# Altium project RK3566.PrjPcb (part 1 of 3)
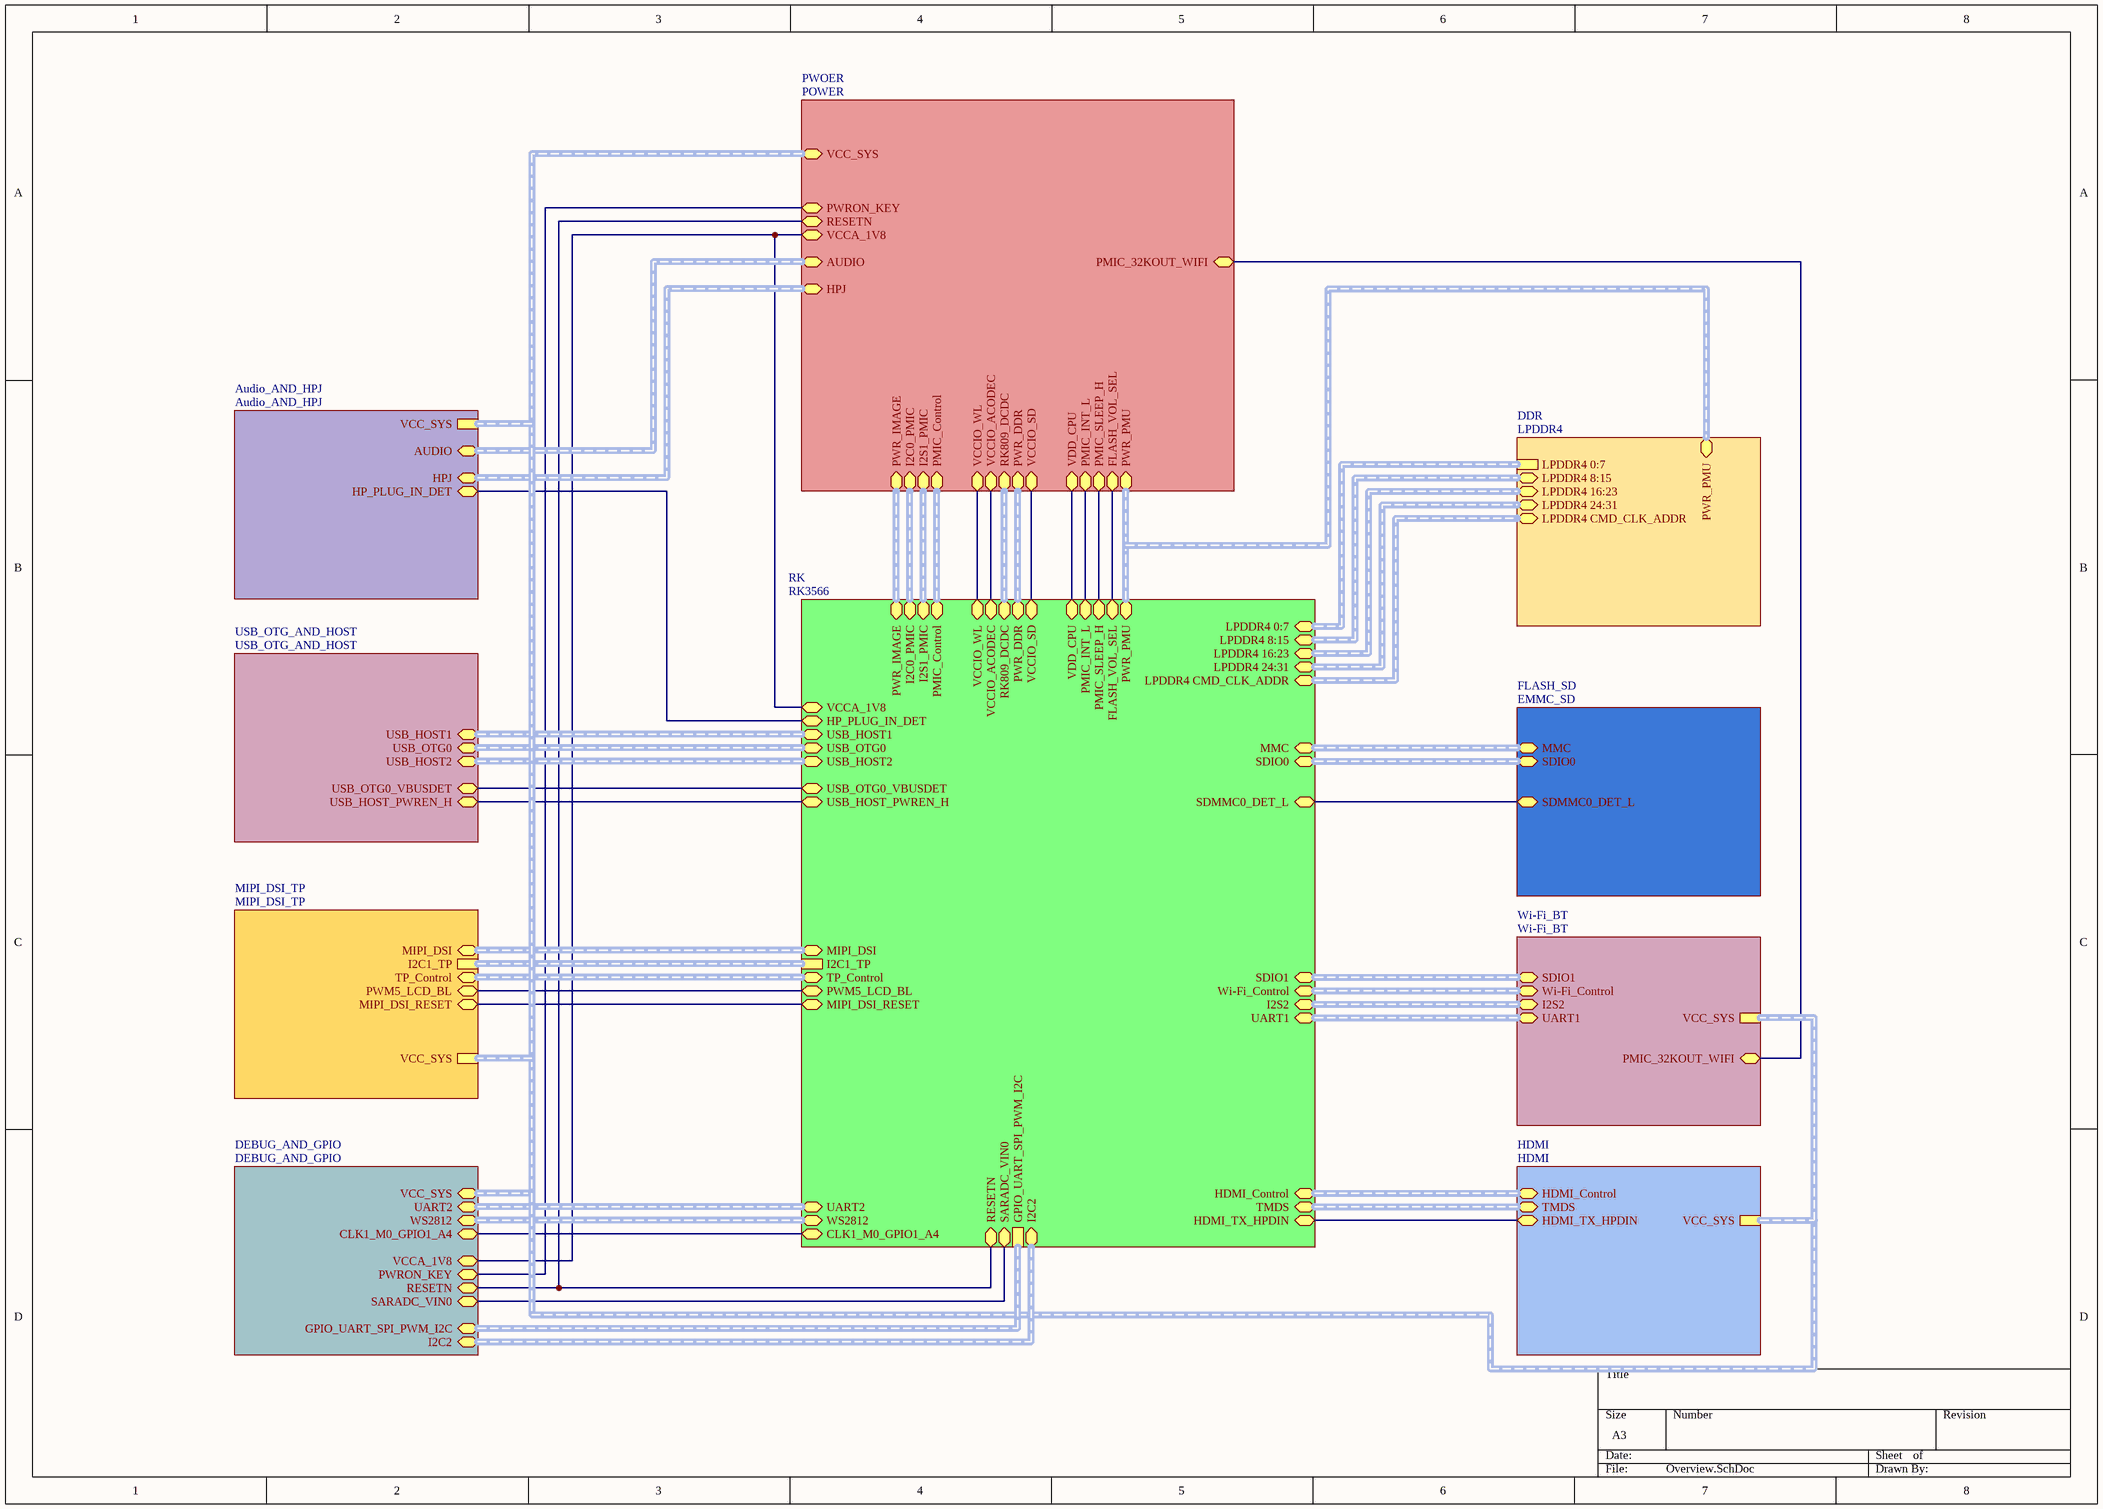
[diagram p0: Overview.SchDoc]
20 sheets, 462 parts. Net scope: hierarchical (ports join the sheet entries above them; power ports are global).
Board file: PCB1.PcbDoc
Sheets:
  Overview.SchDoc
    RK = RK3566.SchDoc
      RK_DDR = RK3566_DDR_PHY.SchDoc
      RK_FLASH_SD_SARADC = RK3566_FLASH_SD_SARADC.SchDoc
      RK_USB_GPIO = RK3566_USB_GPIO.SchDoc
      RK_MIPI_HDMI = RK3566_MIPI_HDMI.SchDoc
      RK_OSC_PLL_PMUO1_2 = RK3566_OSC_PLL_PMUO1_2.SchDoc
      RK_POWER = RK3566_POWER.SchDoc
    DDR = LPDDR4.SchDoc
    FLASH_SD = EMMC_SD.SchDoc
    Wi-Fi_BT = Wi-Fi_BT.SchDoc
    HDMI = HDMI.SchDoc
    MIPI_DSI_TP = MIPI_DSI_TP.SchDoc
    PWOER = POWER.SchDoc
      POWER_PMIC = POWER_PMIC.SchDoc
      POWER_EXTENSION = POWER_EXTENSION.SchDoc
      POWER_FLASH_POWER_MANAGE = POWER_FLASH_POWER_MANAGE.SchDoc
    Audio_AND_HPJ = Audio_AND_HPJ.SchDoc
    DEBUG_AND_GPIO = DEBUG_AND_GPIO.SchDoc
    USB_OTG_AND_HOST = USB_OTG_AND_HOST.SchDoc

## Sheet Overview.SchDoc
size A3; SheetNumber: 1; SheetTotal: 20

### Sub-sheets
Audio_AND_HPJ = Audio_AND_HPJ: AUDIO (bidir), HPJ (bidir), HP_PLUG_IN_DET (bidir), VCC_SYS
DDR = LPDDR4: LPDDR4 0:7, LPDDR4 8:15 (bidir), LPDDR4 16:23 (bidir), LPDDR4 24:31 (bidir), LPDDR4 CMD_CLK_ADDR (bidir), PWR_PMU (bidir)
DEBUG_AND_GPIO = DEBUG_AND_GPIO: UART2 (bidir), WS2812 (bidir), CLK1_M0_GPIO1_A4 (bidir), RESETN (bidir), PWRON_KEY (bidir), SARADC_VIN0 (bidir), VCC_SYS (bidir), VCCA_1V8 (bidir), GPIO_UART_SPI_PWM_I2C (bidir), I2C2 (bidir)
FLASH_SD = EMMC_SD: MMC (bidir), SDIO0 (bidir), SDMMC0_DET_L (bidir)
HDMI = HDMI: TMDS (bidir), HDMI_Control (bidir), HDMI_TX_HPDIN (bidir), VCC_SYS
MIPI_DSI_TP = MIPI_DSI_TP: MIPI_DSI (bidir), I2C1_TP, PWM5_LCD_BL (bidir), MIPI_DSI_RESET (bidir), TP_Control (bidir), VCC_SYS
PWOER = POWER: I2S1_PMIC (bidir), PMIC_Control (bidir), I2C0_PMIC (bidir), AUDIO (bidir), RK809_DCDC (bidir), PMIC_32KOUT_WIFI (bidir), HPJ (bidir), PWR_DDR (bidir), VCCIO_SD (bidir), VCCIO_ACODEC (bidir), VCCIO_WL (bidir), PWR_IMAGE (bidir), VDD_CPU (bidir), PMIC_INT_L (bidir), PMIC_SLEEP_H (bidir), FLASH_VOL_SEL (bidir), PWR_PMU (bidir), PWRON_KEY (bidir), VCC_SYS (bidir), RESETN (bidir), VCCA_1V8 (bidir)
RK = RK3566: LPDDR4 0:7 (bidir), LPDDR4 8:15 (bidir), LPDDR4 16:23 (bidir), LPDDR4 24:31 (bidir), LPDDR4 CMD_CLK_ADDR (bidir), MIPI_DSI (bidir), MMC (bidir), SDIO0 (bidir), SDMMC0_DET_L (bidir), I2C1_TP, TP_Control (bidir), PWM5_LCD_BL (bidir), MIPI_DSI_RESET (bidir), SDIO1 (bidir), Wi-Fi_Control (bidir), I2S2 (bidir), UART1 (bidir), HDMI_Control (bidir), TMDS (bidir), HDMI_TX_HPDIN (bidir), I2S1_PMIC (bidir), PMIC_Control (bidir), I2C0_PMIC (bidir), RK809_DCDC (bidir), UART2 (bidir), USB_OTG0 (bidir), USB_HOST2 (bidir), USB_OTG0_VBUSDET (bidir), USB_HOST_PWREN_H (bidir), USB_HOST1 (bidir), HP_PLUG_IN_DET (bidir), PWR_DDR (bidir), VCCIO_SD (bidir), VCCIO_ACODEC (bidir), VCCIO_WL (bidir), WS2812 (bidir), CLK1_M0_GPIO1_A4 (bidir), PWR_IMAGE (bidir), VDD_CPU (bidir), PMIC_INT_L (bidir), PMIC_SLEEP_H (bidir), FLASH_VOL_SEL (bidir), PWR_PMU (bidir), RESETN (bidir), SARADC_VIN0 (bidir), VCCA_1V8 (bidir), GPIO_UART_SPI_PWM_I2C, I2C2 (bidir)
USB_OTG_AND_HOST = USB_OTG_AND_HOST: USB_OTG0 (bidir), USB_HOST2 (bidir), USB_OTG0_VBUSDET (bidir), USB_HOST_PWREN_H (bidir), USB_HOST1 (bidir)
Wi-Fi_BT = Wi-Fi_BT: SDIO1 (bidir), Wi-Fi_Control (bidir), I2S2 (bidir), UART1 (bidir), PMIC_32KOUT_WIFI (bidir), VCC_SYS

### Nets
VCCA_1V8: sheet RK/VCCA_1V8, sheet PWOER/VCCA_1V8, sheet DEBUG_AND_GPIO/VCCA_1V8
VCCIO_ACODEC: sheet RK/VCCIO_ACODEC, sheet PWOER/VCCIO_ACODEC
VCCIO_SD: sheet RK/VCCIO_SD, sheet PWOER/VCCIO_SD
VCCIO_WL: sheet RK/VCCIO_WL, sheet PWOER/VCCIO_WL
VDD_CPU: sheet RK/VDD_CPU, sheet PWOER/VDD_CPU
CLK1_M0_GPIO1_A4: sheet RK/CLK1_M0_GPIO1_A4, sheet DEBUG_AND_GPIO/CLK1_M0_GPIO1_A4
FLASH_VOL_SEL: sheet RK/FLASH_VOL_SEL, sheet PWOER/FLASH_VOL_SEL
HDMI_TX_HPDIN: sheet RK/HDMI_TX_HPDIN, sheet HDMI/HDMI_TX_HPDIN
HP_PLUG_IN_DET: sheet RK/HP_PLUG_IN_DET, sheet Audio_AND_HPJ/HP_PLUG_IN_DET
MIPI_DSI_RESET: sheet RK/MIPI_DSI_RESET, sheet MIPI_DSI_TP/MIPI_DSI_RESET
PMIC_32KOUT_WIFI: sheet Wi-Fi_BT/PMIC_32KOUT_WIFI, sheet PWOER/PMIC_32KOUT_WIFI
PMIC_INT_L: sheet RK/PMIC_INT_L, sheet PWOER/PMIC_INT_L
PMIC_SLEEP_H: sheet RK/PMIC_SLEEP_H, sheet PWOER/PMIC_SLEEP_H
PWM5_LCD_BL: sheet RK/PWM5_LCD_BL, sheet MIPI_DSI_TP/PWM5_LCD_BL
PWRON_KEY: sheet PWOER/PWRON_KEY, sheet DEBUG_AND_GPIO/PWRON_KEY
RESETN: sheet RK/RESETN, sheet PWOER/RESETN, sheet DEBUG_AND_GPIO/RESETN
SARADC_VIN0: sheet RK/SARADC_VIN0, sheet DEBUG_AND_GPIO/SARADC_VIN0
SDMMC0_DET_L: sheet RK/SDMMC0_DET_L, sheet FLASH_SD/SDMMC0_DET_L
USB_HOST_PWREN_H: sheet RK/USB_HOST_PWREN_H, sheet USB_OTG_AND_HOST/USB_HOST_PWREN_H
USB_OTG0_VBUSDET: sheet RK/USB_OTG0_VBUSDET, sheet USB_OTG_AND_HOST/USB_OTG0_VBUSDET

### Buses and harness runs
harness sheet Audio_AND_HPJ/AUDIO = sheet PWOER/AUDIO
harness sheet Audio_AND_HPJ/HPJ = sheet PWOER/HPJ
harness sheet Audio_AND_HPJ/VCC_SYS = sheet DEBUG_AND_GPIO/VCC_SYS = sheet HDMI/VCC_SYS = sheet MIPI_DSI_TP/VCC_SYS = sheet PWOER/VCC_SYS = sheet Wi-Fi_BT/VCC_SYS
harness sheet DDR/LPDDR4 0:7 = sheet RK/LPDDR4 0:7
harness sheet DDR/LPDDR4 8:15 = sheet RK/LPDDR4 8:15
harness sheet DDR/LPDDR4 16:23 = sheet RK/LPDDR4 16:23
harness sheet DDR/LPDDR4 24:31 = sheet RK/LPDDR4 24:31
harness sheet DDR/LPDDR4 CMD_CLK_ADDR = sheet RK/LPDDR4 CMD_CLK_ADDR
harness sheet DDR/PWR_PMU = sheet PWOER/PWR_PMU = sheet RK/PWR_PMU
harness sheet DEBUG_AND_GPIO/GPIO_UART_SPI_PWM_I2C = sheet RK/GPIO_UART_SPI_PWM_I2C
harness sheet DEBUG_AND_GPIO/I2C2 = sheet RK/I2C2
harness sheet DEBUG_AND_GPIO/UART2 = sheet RK/UART2
harness sheet DEBUG_AND_GPIO/WS2812 = sheet RK/WS2812
harness sheet FLASH_SD/MMC = sheet RK/MMC
harness sheet FLASH_SD/SDIO0 = sheet RK/SDIO0
harness sheet HDMI/HDMI_Control = sheet RK/HDMI_Control
harness sheet HDMI/TMDS = sheet RK/TMDS
harness sheet MIPI_DSI_TP/I2C1_TP = sheet RK/I2C1_TP
harness sheet MIPI_DSI_TP/MIPI_DSI = sheet RK/MIPI_DSI
harness sheet MIPI_DSI_TP/TP_Control = sheet RK/TP_Control
harness sheet PWOER/I2C0_PMIC = sheet RK/I2C0_PMIC
harness sheet PWOER/I2S1_PMIC = sheet RK/I2S1_PMIC
harness sheet PWOER/PMIC_Control = sheet RK/PMIC_Control
harness sheet PWOER/PWR_DDR = sheet RK/PWR_DDR
harness sheet PWOER/PWR_IMAGE = sheet RK/PWR_IMAGE
harness sheet PWOER/RK809_DCDC = sheet RK/RK809_DCDC
harness sheet RK/I2S2 = sheet Wi-Fi_BT/I2S2
harness sheet RK/SDIO1 = sheet Wi-Fi_BT/SDIO1
harness sheet RK/UART1 = sheet Wi-Fi_BT/UART1
harness sheet RK/USB_HOST1 = sheet USB_OTG_AND_HOST/USB_HOST1
harness sheet RK/USB_HOST2 = sheet USB_OTG_AND_HOST/USB_HOST2
harness sheet RK/USB_OTG0 = sheet USB_OTG_AND_HOST/USB_OTG0
harness sheet RK/Wi-Fi_Control = sheet Wi-Fi_BT/Wi-Fi_Control

## Sheet RK3566.SchDoc
size A3; SheetNumber: 14; SheetTotal: 20
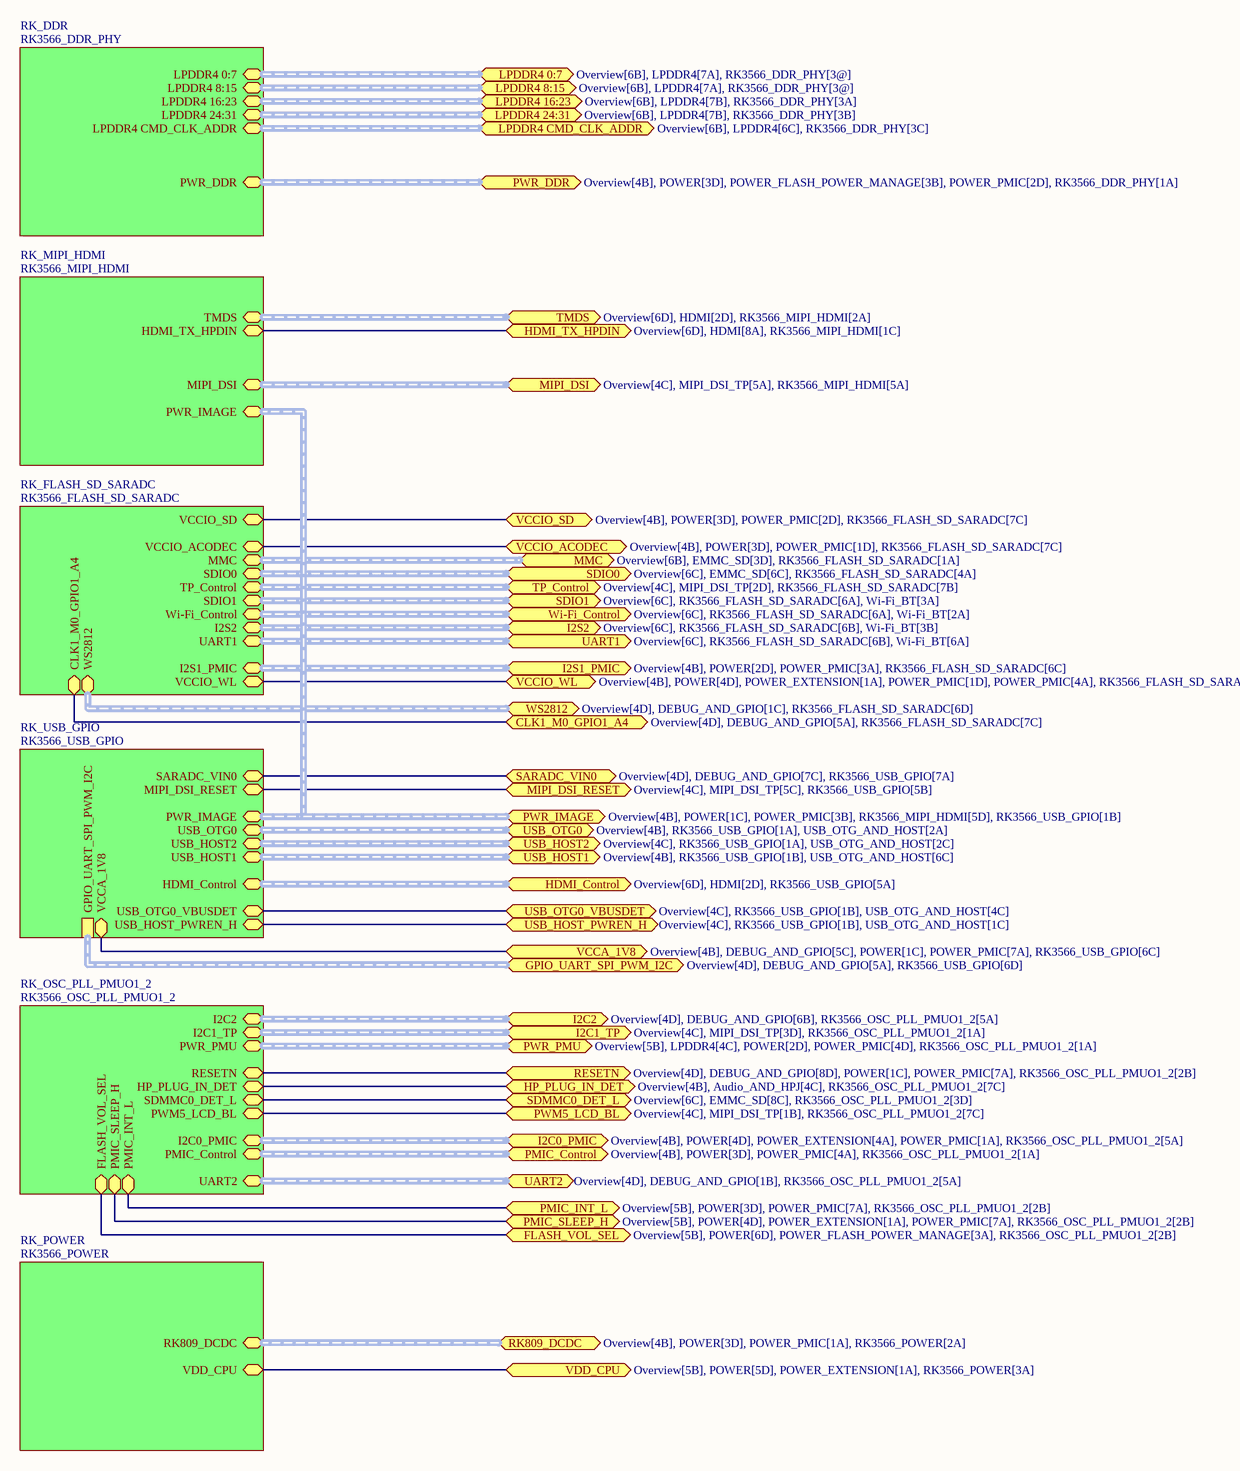
[diagram p1: RK3566.SchDoc]

### Sub-sheets
RK_DDR = RK3566_DDR_PHY: LPDDR4 0:7 (bidir), LPDDR4 8:15 (bidir), LPDDR4 16:23 (bidir), LPDDR4 24:31 (bidir), LPDDR4 CMD_CLK_ADDR (bidir), PWR_DDR (bidir)
RK_FLASH_SD_SARADC = RK3566_FLASH_SD_SARADC: MMC (bidir), SDIO0 (bidir), SDIO1 (bidir), Wi-Fi_Control (bidir), I2S2 (bidir), UART1 (bidir), TP_Control (bidir), I2S1_PMIC (bidir), VCCIO_SD (bidir), VCCIO_ACODEC (bidir), VCCIO_WL (bidir), CLK1_M0_GPIO1_A4 (bidir), WS2812 (bidir)
RK_MIPI_HDMI = RK3566_MIPI_HDMI: TMDS (bidir), MIPI_DSI (bidir), HDMI_TX_HPDIN (bidir), PWR_IMAGE (bidir)
RK_OSC_PLL_PMUO1_2 = RK3566_OSC_PLL_PMUO1_2: I2C1_TP (bidir), PWM5_LCD_BL (bidir), SDMMC0_DET_L (bidir), PMIC_Control (bidir), I2C0_PMIC (bidir), UART2 (bidir), HP_PLUG_IN_DET (bidir), PWR_PMU (bidir), PMIC_INT_L (bidir), PMIC_SLEEP_H (bidir), FLASH_VOL_SEL (bidir), RESETN (bidir), I2C2 (bidir)
RK_POWER = RK3566_POWER: RK809_DCDC (bidir), VDD_CPU (bidir)
RK_USB_GPIO = RK3566_USB_GPIO: HDMI_Control (bidir), MIPI_DSI_RESET (bidir), USB_OTG0 (bidir), USB_HOST2 (bidir), USB_OTG0_VBUSDET (bidir), USB_HOST_PWREN_H (bidir), USB_HOST1 (bidir), PWR_IMAGE (bidir), SARADC_VIN0 (bidir), VCCA_1V8 (bidir), GPIO_UART_SPI_PWM_I2C

### Ports
CLK1_M0_GPIO1_A4 (bidir, see Overview[4D], DEBUG_AND_GPIO[5A], RK3566_FLASH_SD_SARADC[7C]), FLASH_VOL_SEL (bidir, see Overview[5B], POWER[6D], POWER_FLASH_POWER_MANAGE[3A], RK3566_OSC_PLL_PMUO1_2[2B]), GPIO_UART_SPI_PWM_I2C (bidir, harness GPIO_UART_SPI_PWM_I2C, see Overview[4D], DEBUG_AND_GPIO[5A], RK3566_USB_GPIO[6D]), HDMI_Control (bidir, see Overview[6D], HDMI[2D], RK3566_USB_GPIO[5A]), HDMI_TX_HPDIN (bidir, see Overview[6D], HDMI[8A], RK3566_MIPI_HDMI[1C]), HP_PLUG_IN_DET (bidir, see Overview[4B], Audio_AND_HPJ[4C], RK3566_OSC_PLL_PMUO1_2[7C]), I2C0_PMIC (bidir, harness PMIC_Control, see Overview[4B], POWER[4D], POWER_EXTENSION[4A], POWER_PMIC[1A], RK3566_OSC_PLL_PMUO1_2[5A]), I2C1_TP (bidir, see Overview[4C], MIPI_DSI_TP[3D], RK3566_OSC_PLL_PMUO1_2[1A]), I2C2 (bidir, harness I2C2, see Overview[4D], DEBUG_AND_GPIO[6B], RK3566_OSC_PLL_PMUO1_2[5A]), I2S1_PMIC (bidir, see Overview[4B], POWER[2D], POWER_PMIC[3A], RK3566_FLASH_SD_SARADC[6C]), I2S2 (bidir, see Overview[6C], RK3566_FLASH_SD_SARADC[6B], Wi-Fi_BT[3B]), LPDDR4 0:7 (bidir, see Overview[6B], LPDDR4[7A], RK3566_DDR_PHY[3@]), LPDDR4 8:15 (bidir, see Overview[6B], LPDDR4[7A], RK3566_DDR_PHY[3@]), LPDDR4 16:23 (bidir, see Overview[6B], LPDDR4[7B], RK3566_DDR_PHY[3A]), LPDDR4 24:31 (bidir, see Overview[6B], LPDDR4[7B], RK3566_DDR_PHY[3B]), LPDDR4 CMD_CLK_ADDR (bidir, see Overview[6B], LPDDR4[6C], RK3566_DDR_PHY[3C]), MIPI_DSI (bidir, see Overview[4C], MIPI_DSI_TP[5A], RK3566_MIPI_HDMI[5A]), MIPI_DSI_RESET (bidir, see Overview[4C], MIPI_DSI_TP[5C], RK3566_USB_GPIO[5B]), MMC (bidir, see Overview[6B], EMMC_SD[3D], RK3566_FLASH_SD_SARADC[1A]), PMIC_Control (bidir, harness PMIC_Control, see Overview[4B], POWER[3D], POWER_PMIC[4A], RK3566_OSC_PLL_PMUO1_2[1A]), PMIC_INT_L (bidir, see Overview[5B], POWER[3D], POWER_PMIC[7A], RK3566_OSC_PLL_PMUO1_2[2B]), PMIC_SLEEP_H (bidir, see Overview[5B], POWER[4D], POWER_EXTENSION[1A], POWER_PMIC[7A], RK3566_OSC_PLL_PMUO1_2[2B]), PWM5_LCD_BL (bidir, see Overview[4C], MIPI_DSI_TP[1B], RK3566_OSC_PLL_PMUO1_2[7C]), PWR_DDR (bidir, harness PWR_DDR, see Overview[4B], POWER[3D], POWER_FLASH_POWER_MANAGE[3B], POWER_PMIC[2D], RK3566_DDR_PHY[1A]), PWR_IMAGE (bidir, harness PWR_IMAGE, see Overview[4B], POWER[1C], POWER_PMIC[3B], RK3566_MIPI_HDMI[5D], RK3566_USB_GPIO[1B]), PWR_PMU (bidir, harness PWR_PMU, see Overview[5B], LPDDR4[4C], POWER[2D], POWER_PMIC[4D], RK3566_OSC_PLL_PMUO1_2[1A]), RESETN (bidir, see Overview[4D], DEBUG_AND_GPIO[8D], POWER[1C], POWER_PMIC[7A], RK3566_OSC_PLL_PMUO1_2[2B]), RK809_DCDC (bidir, harness RK809_DCDC, see Overview[4B], POWER[3D], POWER_PMIC[1A], RK3566_POWER[2A]), SARADC_VIN0 (bidir, see Overview[4D], DEBUG_AND_GPIO[7C], RK3566_USB_GPIO[7A]), SDIO0 (bidir, see Overview[6C], EMMC_SD[6C], RK3566_FLASH_SD_SARADC[4A]), SDIO1 (bidir, see Overview[6C], RK3566_FLASH_SD_SARADC[6A], Wi-Fi_BT[3A]), SDMMC0_DET_L (bidir, see Overview[6C], EMMC_SD[8C], RK3566_OSC_PLL_PMUO1_2[3D]), TMDS (bidir, see Overview[6D], HDMI[2D], RK3566_MIPI_HDMI[2A]), TP_Control (bidir, see Overview[4C], MIPI_DSI_TP[2D], RK3566_FLASH_SD_SARADC[7B]), UART1 (bidir, see Overview[6C], RK3566_FLASH_SD_SARADC[6B], Wi-Fi_BT[6A]), UART2 (bidir, harness PMIC_Control, see Overview[4D], DEBUG_AND_GPIO[1B], RK3566_OSC_PLL_PMUO1_2[5A]), USB_HOST1 (bidir, harness USB_HOST2, see Overview[4B], RK3566_USB_GPIO[1B], USB_OTG_AND_HOST[6C]), USB_HOST2 (bidir, harness USB_HOST2, see Overview[4C], RK3566_USB_GPIO[1A], USB_OTG_AND_HOST[2C]), USB_HOST_PWREN_H (bidir, see Overview[4C], RK3566_USB_GPIO[1B], USB_OTG_AND_HOST[1C]), USB_OTG0 (bidir, harness USB_OTG0, see Overview[4B], RK3566_USB_GPIO[1A], USB_OTG_AND_HOST[2A]), USB_OTG0_VBUSDET (bidir, see Overview[4C], RK3566_USB_GPIO[1B], USB_OTG_AND_HOST[4C]), VCCA_1V8 (bidir, see Overview[4B], DEBUG_AND_GPIO[5C], POWER[1C], POWER_PMIC[7A], RK3566_USB_GPIO[6C]), VCCIO_ACODEC (bidir, see Overview[4B], POWER[3D], POWER_PMIC[1D], RK3566_FLASH_SD_SARADC[7C]), VCCIO_SD (bidir, see Overview[4B], POWER[3D], POWER_PMIC[2D], RK3566_FLASH_SD_SARADC[7C]), VCCIO_WL (bidir, see Overview[4B], POWER[4D], POWER_EXTENSION[1A], POWER_PMIC[1D], POWER_PMIC[4A], RK3566_FLASH_SD_SARADC[7C]), VDD_CPU (bidir, see Overview[5B], POWER[5D], POWER_EXTENSION[1A], RK3566_POWER[3A]), Wi-Fi_Control (bidir, see Overview[6C], RK3566_FLASH_SD_SARADC[6A], Wi-Fi_BT[2A]), WS2812 (bidir, harness WS2812, see Overview[4D], DEBUG_AND_GPIO[1C], RK3566_FLASH_SD_SARADC[6D])

### Nets
VCCA_1V8: port VCCA_1V8, sheet RK_USB_GPIO/VCCA_1V8
VCCIO_ACODEC: port VCCIO_ACODEC, sheet RK_FLASH_SD_SARADC/VCCIO_ACODEC
VCCIO_SD: port VCCIO_SD, sheet RK_FLASH_SD_SARADC/VCCIO_SD
VCCIO_WL: port VCCIO_WL, sheet RK_FLASH_SD_SARADC/VCCIO_WL
VDD_CPU: port VDD_CPU, sheet RK_POWER/VDD_CPU
CLK1_M0_GPIO1_A4: port CLK1_M0_GPIO1_A4, sheet RK_FLASH_SD_SARADC/CLK1_M0_GPIO1_A4
FLASH_VOL_SEL: port FLASH_VOL_SEL, sheet RK_OSC_PLL_PMUO1_2/FLASH_VOL_SEL
HDMI_TX_HPDIN: port HDMI_TX_HPDIN, sheet RK_MIPI_HDMI/HDMI_TX_HPDIN
HP_PLUG_IN_DET: port HP_PLUG_IN_DET, sheet RK_OSC_PLL_PMUO1_2/HP_PLUG_IN_DET
MIPI_DSI_RESET: port MIPI_DSI_RESET, sheet RK_USB_GPIO/MIPI_DSI_RESET
PMIC_INT_L: port PMIC_INT_L, sheet RK_OSC_PLL_PMUO1_2/PMIC_INT_L
PMIC_SLEEP_H: port PMIC_SLEEP_H, sheet RK_OSC_PLL_PMUO1_2/PMIC_SLEEP_H
PWM5_LCD_BL: port PWM5_LCD_BL, sheet RK_OSC_PLL_PMUO1_2/PWM5_LCD_BL
RESETN: port RESETN, sheet RK_OSC_PLL_PMUO1_2/RESETN
SARADC_VIN0: port SARADC_VIN0, sheet RK_USB_GPIO/SARADC_VIN0
SDMMC0_DET_L: port SDMMC0_DET_L, sheet RK_OSC_PLL_PMUO1_2/SDMMC0_DET_L
USB_HOST_PWREN_H: port USB_HOST_PWREN_H, sheet RK_USB_GPIO/USB_HOST_PWREN_H
USB_OTG0_VBUSDET: port USB_OTG0_VBUSDET, sheet RK_USB_GPIO/USB_OTG0_VBUSDET

### Buses and harness runs
harness port GPIO_UART_SPI_PWM_I2C = sheet RK_USB_GPIO/GPIO_UART_SPI_PWM_I2C
harness port HDMI_Control = sheet RK_USB_GPIO/HDMI_Control
harness port I2C0_PMIC = sheet RK_OSC_PLL_PMUO1_2/I2C0_PMIC
harness port I2C1_TP = sheet RK_OSC_PLL_PMUO1_2/I2C1_TP
harness port I2C2 = sheet RK_OSC_PLL_PMUO1_2/I2C2
harness port I2S1_PMIC = sheet RK_FLASH_SD_SARADC/I2S1_PMIC
harness port I2S2 = sheet RK_FLASH_SD_SARADC/I2S2
harness port LPDDR4 0:7 = sheet RK_DDR/LPDDR4 0:7
harness port LPDDR4 8:15 = sheet RK_DDR/LPDDR4 8:15
harness port LPDDR4 16:23 = sheet RK_DDR/LPDDR4 16:23
harness port LPDDR4 24:31 = sheet RK_DDR/LPDDR4 24:31
harness port LPDDR4 CMD_CLK_ADDR = sheet RK_DDR/LPDDR4 CMD_CLK_ADDR
harness port MIPI_DSI = sheet RK_MIPI_HDMI/MIPI_DSI
harness port MMC = sheet RK_FLASH_SD_SARADC/MMC
harness port PMIC_Control = sheet RK_OSC_PLL_PMUO1_2/PMIC_Control
harness port PWR_DDR = sheet RK_DDR/PWR_DDR
harness port PWR_IMAGE = sheet RK_MIPI_HDMI/PWR_IMAGE = sheet RK_USB_GPIO/PWR_IMAGE
harness port PWR_PMU = sheet RK_OSC_PLL_PMUO1_2/PWR_PMU
harness port RK809_DCDC = sheet RK_POWER/RK809_DCDC
harness port SDIO0 = sheet RK_FLASH_SD_SARADC/SDIO0
harness port SDIO1 = sheet RK_FLASH_SD_SARADC/SDIO1
harness port TMDS = sheet RK_MIPI_HDMI/TMDS
harness port TP_Control = sheet RK_FLASH_SD_SARADC/TP_Control
harness port UART1 = sheet RK_FLASH_SD_SARADC/UART1
harness port UART2 = sheet RK_OSC_PLL_PMUO1_2/UART2
harness port USB_HOST1 = sheet RK_USB_GPIO/USB_HOST1
harness port USB_HOST2 = sheet RK_USB_GPIO/USB_HOST2
harness port USB_OTG0 = sheet RK_USB_GPIO/USB_OTG0
harness port Wi-Fi_Control = sheet RK_FLASH_SD_SARADC/Wi-Fi_Control
harness port WS2812 = sheet RK_FLASH_SD_SARADC/WS2812

## Sheet RK3566_DDR_PHY.SchDoc
size A4; SheetNumber: 16; SheetTotal: 20
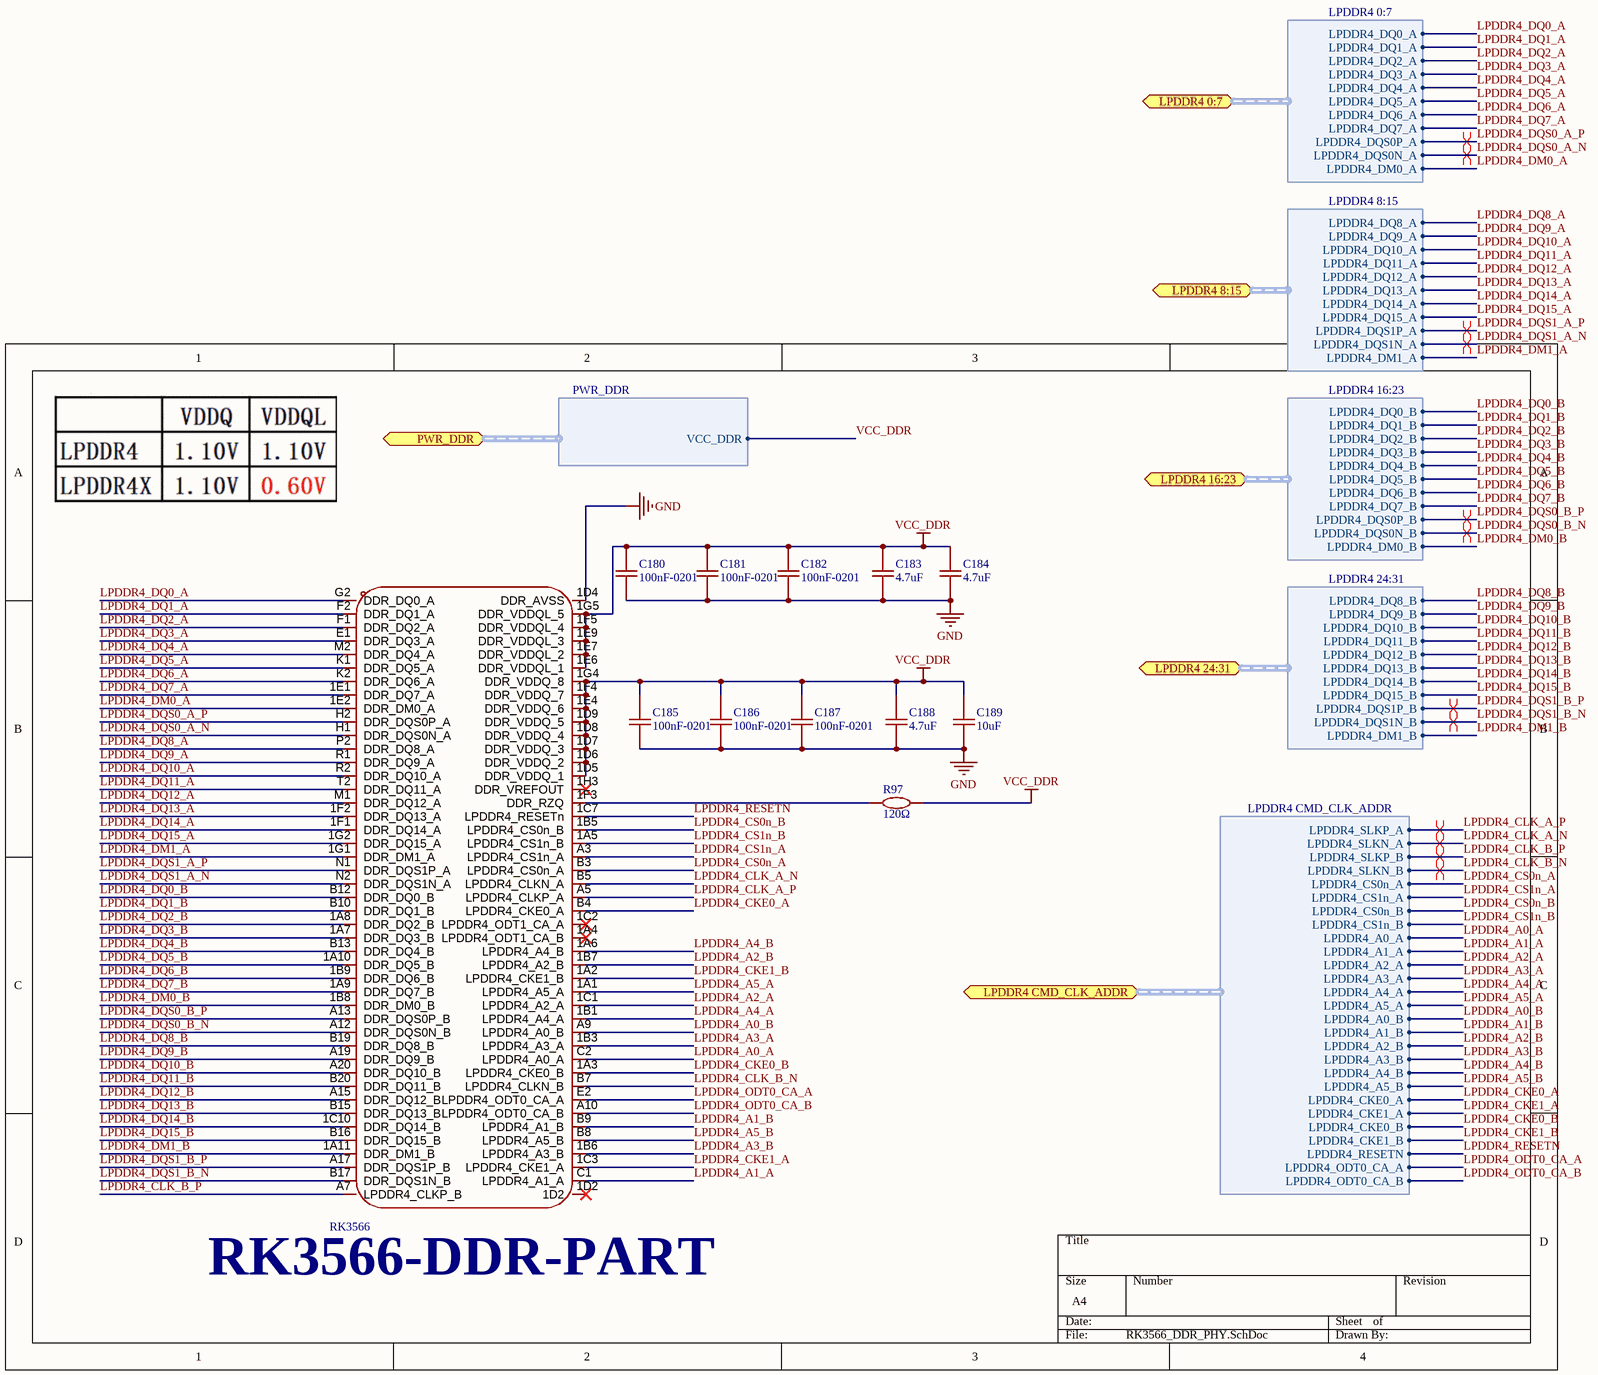
[diagram p2: RK3566_DDR_PHY.SchDoc]

### Parts
C180  100nF-0201  [C0201]
C181  100nF-0201  [C0201]
C182  100nF-0201  [C0201]
C183  4.7uF  [C0402]
C184  4.7uF  [C0402]
C185  100nF-0201  [C0201]
C186  100nF-0201  [C0201]
C187  100nF-0201  [C0201]
C188  4.7uF  [C0402]
C189  10uF  [C0603]
R97  120Ω  [R0402]
U2  RK3566  [BGA-565_L15.5-W14.4-P0.40_RK3566_1]  (part C of 8)

### Ports
LPDDR4 0:7 (bidir, harness LPDDR4 0:7, see RK3566[2A], LPDDR4[7A], RK3566[2A]), LPDDR4 8:15 (bidir, harness LPDDR4 8:15, see RK3566[2A], LPDDR4[7A], RK3566[2A]), LPDDR4 16:23 (bidir, harness LPDDR4 16:23, see RK3566[2A], LPDDR4[7B], RK3566[2A]), LPDDR4 24:31 (bidir, harness LPDDR4 24:31, see RK3566[2A], LPDDR4[7B], RK3566[2A]), LPDDR4 CMD_CLK_ADDR (bidir, harness LPDDR4 CMD_CLK_ADDR, see RK3566[2A], LPDDR4[6C], RK3566[2A]), PWR_DDR (bidir, harness PWR_DDR, see RK3566[2A], POWER[3D], POWER_FLASH_POWER_MANAGE[3B], POWER_PMIC[2D], RK3566[2A])

### Harnesses
PWR_DDR: VCC_DDR
LPDDR4 0:7: LPDDR4_DQ0_A, LPDDR4_DQ1_A, LPDDR4_DQ2_A, LPDDR4_DQ3_A, LPDDR4_DQ4_A, LPDDR4_DQ5_A, LPDDR4_DQ6_A, LPDDR4_DQ7_A, LPDDR4_DQS0P_A, LPDDR4_DQS0N_A, LPDDR4_DM0_A
LPDDR4 8:15: LPDDR4_DQ8_A, LPDDR4_DQ9_A, LPDDR4_DQ10_A, LPDDR4_DQ11_A, LPDDR4_DQ12_A, LPDDR4_DQ13_A, LPDDR4_DQ14_A, LPDDR4_DQ15_A, LPDDR4_DQS1P_A, LPDDR4_DQS1N_A, LPDDR4_DM1_A
LPDDR4 16:23: LPDDR4_DQ0_B, LPDDR4_DQ1_B, LPDDR4_DQ2_B, LPDDR4_DQ3_B, LPDDR4_DQ4_B, LPDDR4_DQ5_B, LPDDR4_DQ6_B, LPDDR4_DQ7_B, LPDDR4_DQS0P_B, LPDDR4_DQS0N_B, LPDDR4_DM0_B
LPDDR4 24:31: LPDDR4_DQ8_B, LPDDR4_DQ9_B, LPDDR4_DQ10_B, LPDDR4_DQ11_B, LPDDR4_DQ12_B, LPDDR4_DQ13_B, LPDDR4_DQ14_B, LPDDR4_DQ15_B, LPDDR4_DQS1P_B, LPDDR4_DQS1N_B, LPDDR4_DM1_B
LPDDR4 CMD_CLK_ADDR: LPDDR4_SLKP_A, LPDDR4_SLKN_A, LPDDR4_SLKP_B, LPDDR4_SLKN_B, LPDDR4_CS0n_A, LPDDR4_CS1n_A, LPDDR4_CS0n_B, LPDDR4_CS1n_B, LPDDR4_A0_A, LPDDR4_A1_A, LPDDR4_A2_A, LPDDR4_A3_A, LPDDR4_A4_A, LPDDR4_A5_A, LPDDR4_A0_B, LPDDR4_A1_B, LPDDR4_A2_B, LPDDR4_A3_B, LPDDR4_A4_B, LPDDR4_A5_B, LPDDR4_CKE0_A, LPDDR4_CKE1_A, LPDDR4_CKE0_B, LPDDR4_CKE1_B, LPDDR4_RESETN, LPDDR4_ODT0_CA_A, LPDDR4_ODT0_CA_B

### Nets
GND: C180.1 C181.1 C182.1 C183.1 C184.1 C185.1 C186.1 C187.1 C188.1 C189.1 U2.1D4(DDR_AVSS)
VCC_DDR: C180.2 C181.2 C182.2 C183.2 C184.2 C185.2 C186.2 C187.2 C188.2 C189.2 R97.2 U2.1D5(DDR_VDDQ_1) U2.1D6(DDR_VDDQ_2) U2.1D7(DDR_VDDQ_3) U2.1D8(DDR_VDDQ_4) U2.1D9(DDR_VDDQ_5) U2.1E4(DDR_VDDQ_6) U2.1E6(DDR_VDDQL_1) U2.1E7(DDR_VDDQL_2) U2.1E9(DDR_VDDQL_3) U2.1F4(DDR_VDDQ_7) U2.1F5(DDR_VDDQL_4) U2.1G4(DDR_VDDQ_8) U2.1G5(DDR_VDDQL_5) ; port PWR_DDR.VCC_DDR
LPDDR4_A0_A: U2.C2(LPDDR4_A0_A) ; port LPDDR4 CMD_CLK_ADDR.LPDDR4_A0_A
LPDDR4_A0_B: U2.A9(LPDDR4_A0_B) ; port LPDDR4 CMD_CLK_ADDR.LPDDR4_A0_B
LPDDR4_A1_A: U2.C1(LPDDR4_A1_A) ; port LPDDR4 CMD_CLK_ADDR.LPDDR4_A1_A
LPDDR4_A1_B: U2.B9(LPDDR4_A1_B) ; port LPDDR4 CMD_CLK_ADDR.LPDDR4_A1_B
LPDDR4_A2_A: U2.1C1(LPDDR4_A2_A) ; port LPDDR4 CMD_CLK_ADDR.LPDDR4_A2_A
LPDDR4_A2_B: U2.1B7(LPDDR4_A2_B) ; port LPDDR4 CMD_CLK_ADDR.LPDDR4_A2_B
LPDDR4_A3_A: U2.1B3(LPDDR4_A3_A) ; port LPDDR4 CMD_CLK_ADDR.LPDDR4_A3_A
LPDDR4_A3_B: U2.1B6(LPDDR4_A3_B) ; port LPDDR4 CMD_CLK_ADDR.LPDDR4_A3_B
LPDDR4_A4_A: U2.1B1(LPDDR4_A4_A) ; port LPDDR4 CMD_CLK_ADDR.LPDDR4_A4_A
LPDDR4_A4_B: U2.1A6(LPDDR4_A4_B) ; port LPDDR4 CMD_CLK_ADDR.LPDDR4_A4_B
LPDDR4_A5_A: U2.1A1(LPDDR4_A5_A) ; port LPDDR4 CMD_CLK_ADDR.LPDDR4_A5_A
LPDDR4_A5_B: U2.B8(LPDDR4_A5_B) ; port LPDDR4 CMD_CLK_ADDR.LPDDR4_A5_B
LPDDR4_CKE0_A: U2.B4(LPDDR4_CKE0_A) ; port LPDDR4 CMD_CLK_ADDR.LPDDR4_CKE0_A
LPDDR4_CKE0_B: U2.1A3(LPDDR4_CKE0_B) ; port LPDDR4 CMD_CLK_ADDR.LPDDR4_CKE0_B
LPDDR4_CKE1_A: U2.1C3(LPDDR4_CKE1_A) ; port LPDDR4 CMD_CLK_ADDR.LPDDR4_CKE1_A
LPDDR4_CKE1_B: U2.1A2(LPDDR4_CKE1_B) ; port LPDDR4 CMD_CLK_ADDR.LPDDR4_CKE1_B
LPDDR4_CLK_A_N: U2.B5(LPDDR4_CLKN_A) ; port LPDDR4 CMD_CLK_ADDR.LPDDR4_SLKN_A
LPDDR4_CLK_A_P: U2.A5(LPDDR4_CLKP_A) ; port LPDDR4 CMD_CLK_ADDR.LPDDR4_SLKP_A
LPDDR4_CLK_B_N: U2.B7(LPDDR4_CLKN_B) ; port LPDDR4 CMD_CLK_ADDR.LPDDR4_SLKN_B
LPDDR4_CLK_B_P: U2.A7(LPDDR4_CLKP_B) ; port LPDDR4 CMD_CLK_ADDR.LPDDR4_SLKP_B
LPDDR4_CS0n_A: U2.B3(LPDDR4_CS0n_A) ; port LPDDR4 CMD_CLK_ADDR.LPDDR4_CS0n_A
LPDDR4_CS0n_B: U2.1B5(LPDDR4_CS0n_B) ; port LPDDR4 CMD_CLK_ADDR.LPDDR4_CS0n_B
LPDDR4_CS1n_A: U2.A3(LPDDR4_CS1n_A) ; port LPDDR4 CMD_CLK_ADDR.LPDDR4_CS1n_A
LPDDR4_CS1n_B: U2.1A5(LPDDR4_CS1n_B) ; port LPDDR4 CMD_CLK_ADDR.LPDDR4_CS1n_B
LPDDR4_DM0_A: U2.1E2(DDR_DM0_A) ; port LPDDR4 0:7.LPDDR4_DM0_A
LPDDR4_DM0_B: U2.1B8(DDR_DM0_B) ; port LPDDR4 16:23.LPDDR4_DM0_B
LPDDR4_DM1_A: U2.1G1(DDR_DM1_A) ; port LPDDR4 8:15.LPDDR4_DM1_A
LPDDR4_DM1_B: U2.1A11(DDR_DM1_B) ; port LPDDR4 24:31.LPDDR4_DM1_B
LPDDR4_DQ0_A: U2.G2(DDR_DQ0_A) ; port LPDDR4 0:7.LPDDR4_DQ0_A
LPDDR4_DQ0_B: U2.B12(DDR_DQ0_B) ; port LPDDR4 16:23.LPDDR4_DQ0_B
LPDDR4_DQ1_A: U2.F2(DDR_DQ1_A) ; port LPDDR4 0:7.LPDDR4_DQ1_A
LPDDR4_DQ1_B: U2.B10(DDR_DQ1_B) ; port LPDDR4 16:23.LPDDR4_DQ1_B
LPDDR4_DQ2_A: U2.F1(DDR_DQ2_A) ; port LPDDR4 0:7.LPDDR4_DQ2_A
LPDDR4_DQ2_B: U2.1A8(DDR_DQ2_B) ; port LPDDR4 16:23.LPDDR4_DQ2_B
LPDDR4_DQ3_A: U2.E1(DDR_DQ3_A) ; port LPDDR4 0:7.LPDDR4_DQ3_A
LPDDR4_DQ3_B: U2.1A7(DDR_DQ3_B) ; port LPDDR4 16:23.LPDDR4_DQ3_B
LPDDR4_DQ4_A: U2.M2(DDR_DQ4_A) ; port LPDDR4 0:7.LPDDR4_DQ4_A
LPDDR4_DQ4_B: U2.B13(DDR_DQ4_B) ; port LPDDR4 16:23.LPDDR4_DQ4_B
LPDDR4_DQ5_A: U2.K1(DDR_DQ5_A) ; port LPDDR4 0:7.LPDDR4_DQ5_A
LPDDR4_DQ5_B: U2.1A10(DDR_DQ5_B) ; port LPDDR4 16:23.LPDDR4_DQ5_B
LPDDR4_DQ6_A: U2.K2(DDR_DQ6_A) ; port LPDDR4 0:7.LPDDR4_DQ6_A
LPDDR4_DQ6_B: U2.1B9(DDR_DQ6_B) ; port LPDDR4 16:23.LPDDR4_DQ6_B
LPDDR4_DQ7_A: U2.1E1(DDR_DQ7_A) ; port LPDDR4 0:7.LPDDR4_DQ7_A
LPDDR4_DQ7_B: U2.1A9(DDR_DQ7_B) ; port LPDDR4 16:23.LPDDR4_DQ7_B
LPDDR4_DQ8_A: U2.P2(DDR_DQ8_A) ; port LPDDR4 8:15.LPDDR4_DQ8_A
LPDDR4_DQ8_B: U2.B19(DDR_DQ8_B) ; port LPDDR4 24:31.LPDDR4_DQ8_B
LPDDR4_DQ9_A: U2.R1(DDR_DQ9_A) ; port LPDDR4 8:15.LPDDR4_DQ9_A
LPDDR4_DQ9_B: U2.A19(DDR_DQ9_B) ; port LPDDR4 24:31.LPDDR4_DQ9_B
LPDDR4_DQ10_A: U2.R2(DDR_DQ10_A) ; port LPDDR4 8:15.LPDDR4_DQ10_A
LPDDR4_DQ10_B: U2.A20(DDR_DQ10_B) ; port LPDDR4 24:31.LPDDR4_DQ10_B
LPDDR4_DQ11_A: U2.T2(DDR_DQ11_A) ; port LPDDR4 8:15.LPDDR4_DQ11_A
LPDDR4_DQ11_B: U2.B20(DDR_DQ11_B) ; port LPDDR4 24:31.LPDDR4_DQ11_B
LPDDR4_DQ12_A: U2.M1(DDR_DQ12_A) ; port LPDDR4 8:15.LPDDR4_DQ12_A
LPDDR4_DQ12_B: U2.A15(DDR_DQ12_B) ; port LPDDR4 24:31.LPDDR4_DQ12_B
LPDDR4_DQ13_A: U2.1F2(DDR_DQ13_A) ; port LPDDR4 8:15.LPDDR4_DQ13_A
LPDDR4_DQ13_B: U2.B15(DDR_DQ13_B) ; port LPDDR4 24:31.LPDDR4_DQ13_B
LPDDR4_DQ14_A: U2.1F1(DDR_DQ14_A) ; port LPDDR4 8:15.LPDDR4_DQ14_A
LPDDR4_DQ14_B: U2.1C10(DDR_DQ14_B) ; port LPDDR4 24:31.LPDDR4_DQ14_B
LPDDR4_DQ15_A: U2.1G2(DDR_DQ15_A) ; port LPDDR4 8:15.LPDDR4_DQ15_A
LPDDR4_DQ15_B: U2.B16(DDR_DQ15_B) ; port LPDDR4 24:31.LPDDR4_DQ15_B
LPDDR4_DQS0_A_N: U2.H1(DDR_DQS0N_A) ; port LPDDR4 0:7.LPDDR4_DQS0N_A
LPDDR4_DQS0_A_P: U2.H2(DDR_DQS0P_A) ; port LPDDR4 0:7.LPDDR4_DQS0P_A
LPDDR4_DQS0_B_N: U2.A12(DDR_DQS0N_B) ; port LPDDR4 16:23.LPDDR4_DQS0N_B
LPDDR4_DQS0_B_P: U2.A13(DDR_DQS0P_B) ; port LPDDR4 16:23.LPDDR4_DQS0P_B
LPDDR4_DQS1_A_N: U2.N2(DDR_DQS1N_A) ; port LPDDR4 8:15.LPDDR4_DQS1N_A
LPDDR4_DQS1_A_P: U2.N1(DDR_DQS1P_A) ; port LPDDR4 8:15.LPDDR4_DQS1P_A
LPDDR4_DQS1_B_N: U2.B17(DDR_DQS1N_B) ; port LPDDR4 24:31.LPDDR4_DQS1N_B
LPDDR4_DQS1_B_P: U2.A17(DDR_DQS1P_B) ; port LPDDR4 24:31.LPDDR4_DQS1P_B
LPDDR4_ODT0_CA_A: U2.E2(LPDDR4_ODT0_CA_A) ; port LPDDR4 CMD_CLK_ADDR.LPDDR4_ODT0_CA_A
LPDDR4_ODT0_CA_B: U2.A10(LPDDR4_ODT0_CA_B) ; port LPDDR4 CMD_CLK_ADDR.LPDDR4_ODT0_CA_B
LPDDR4_RESETN: U2.1C7(LPDDR4_RESETn) ; port LPDDR4 CMD_CLK_ADDR.LPDDR4_RESETN
NetR97_1: R97.1 U2.1F3(DDR_RZQ)

Not connected (* = marked no-connect by the designer): U2 1A4(LPDDR4_ODT1_CA_B)* 1C2(LPDDR4_ODT1_CA_A)* 1D2* 1H3(DDR_VREFOUT)*

### Layout directives
differential pair: LPDDR4_CLK_A_N, LPDDR4_CLK_A_P, LPDDR4_CLK_B_N, LPDDR4_CLK_B_P, LPDDR4_DQS0_A_N, LPDDR4_DQS0_A_P, LPDDR4_DQS0_B_N, LPDDR4_DQS0_B_P, LPDDR4_DQS1_A_N, LPDDR4_DQS1_A_P, LPDDR4_DQS1_B_N, LPDDR4_DQS1_B_P

### Notes on the sheet
- (near U2) RK3566-DDR-PART

### Library data of the parts
C180-C182 C185-C187 = 100nF-0201: CL03A104KO3NNNC
C183 C184 C188 = 4.7uF: 10V 4.7uF X5R ±20% 0402 Ceramic Capacitors ROHS
C189 = 10uF: 10V 10uF X5R ±10% 0603 Ceramic Capacitors ROHS
R97 = 120Ω: 62.5mW 120Ω 50V ±100ppm/℃ Thick Film Resistor ±1% 0402 Chip Resistor - Surface Mount ROHS
U2 = RK3566: BGA-565(15.5x14.4); Symbol: RK3566

## Sheet RK3566_FLASH_SD_SARADC.SchDoc
size A3; SheetNumber: 17; SheetTotal: 20
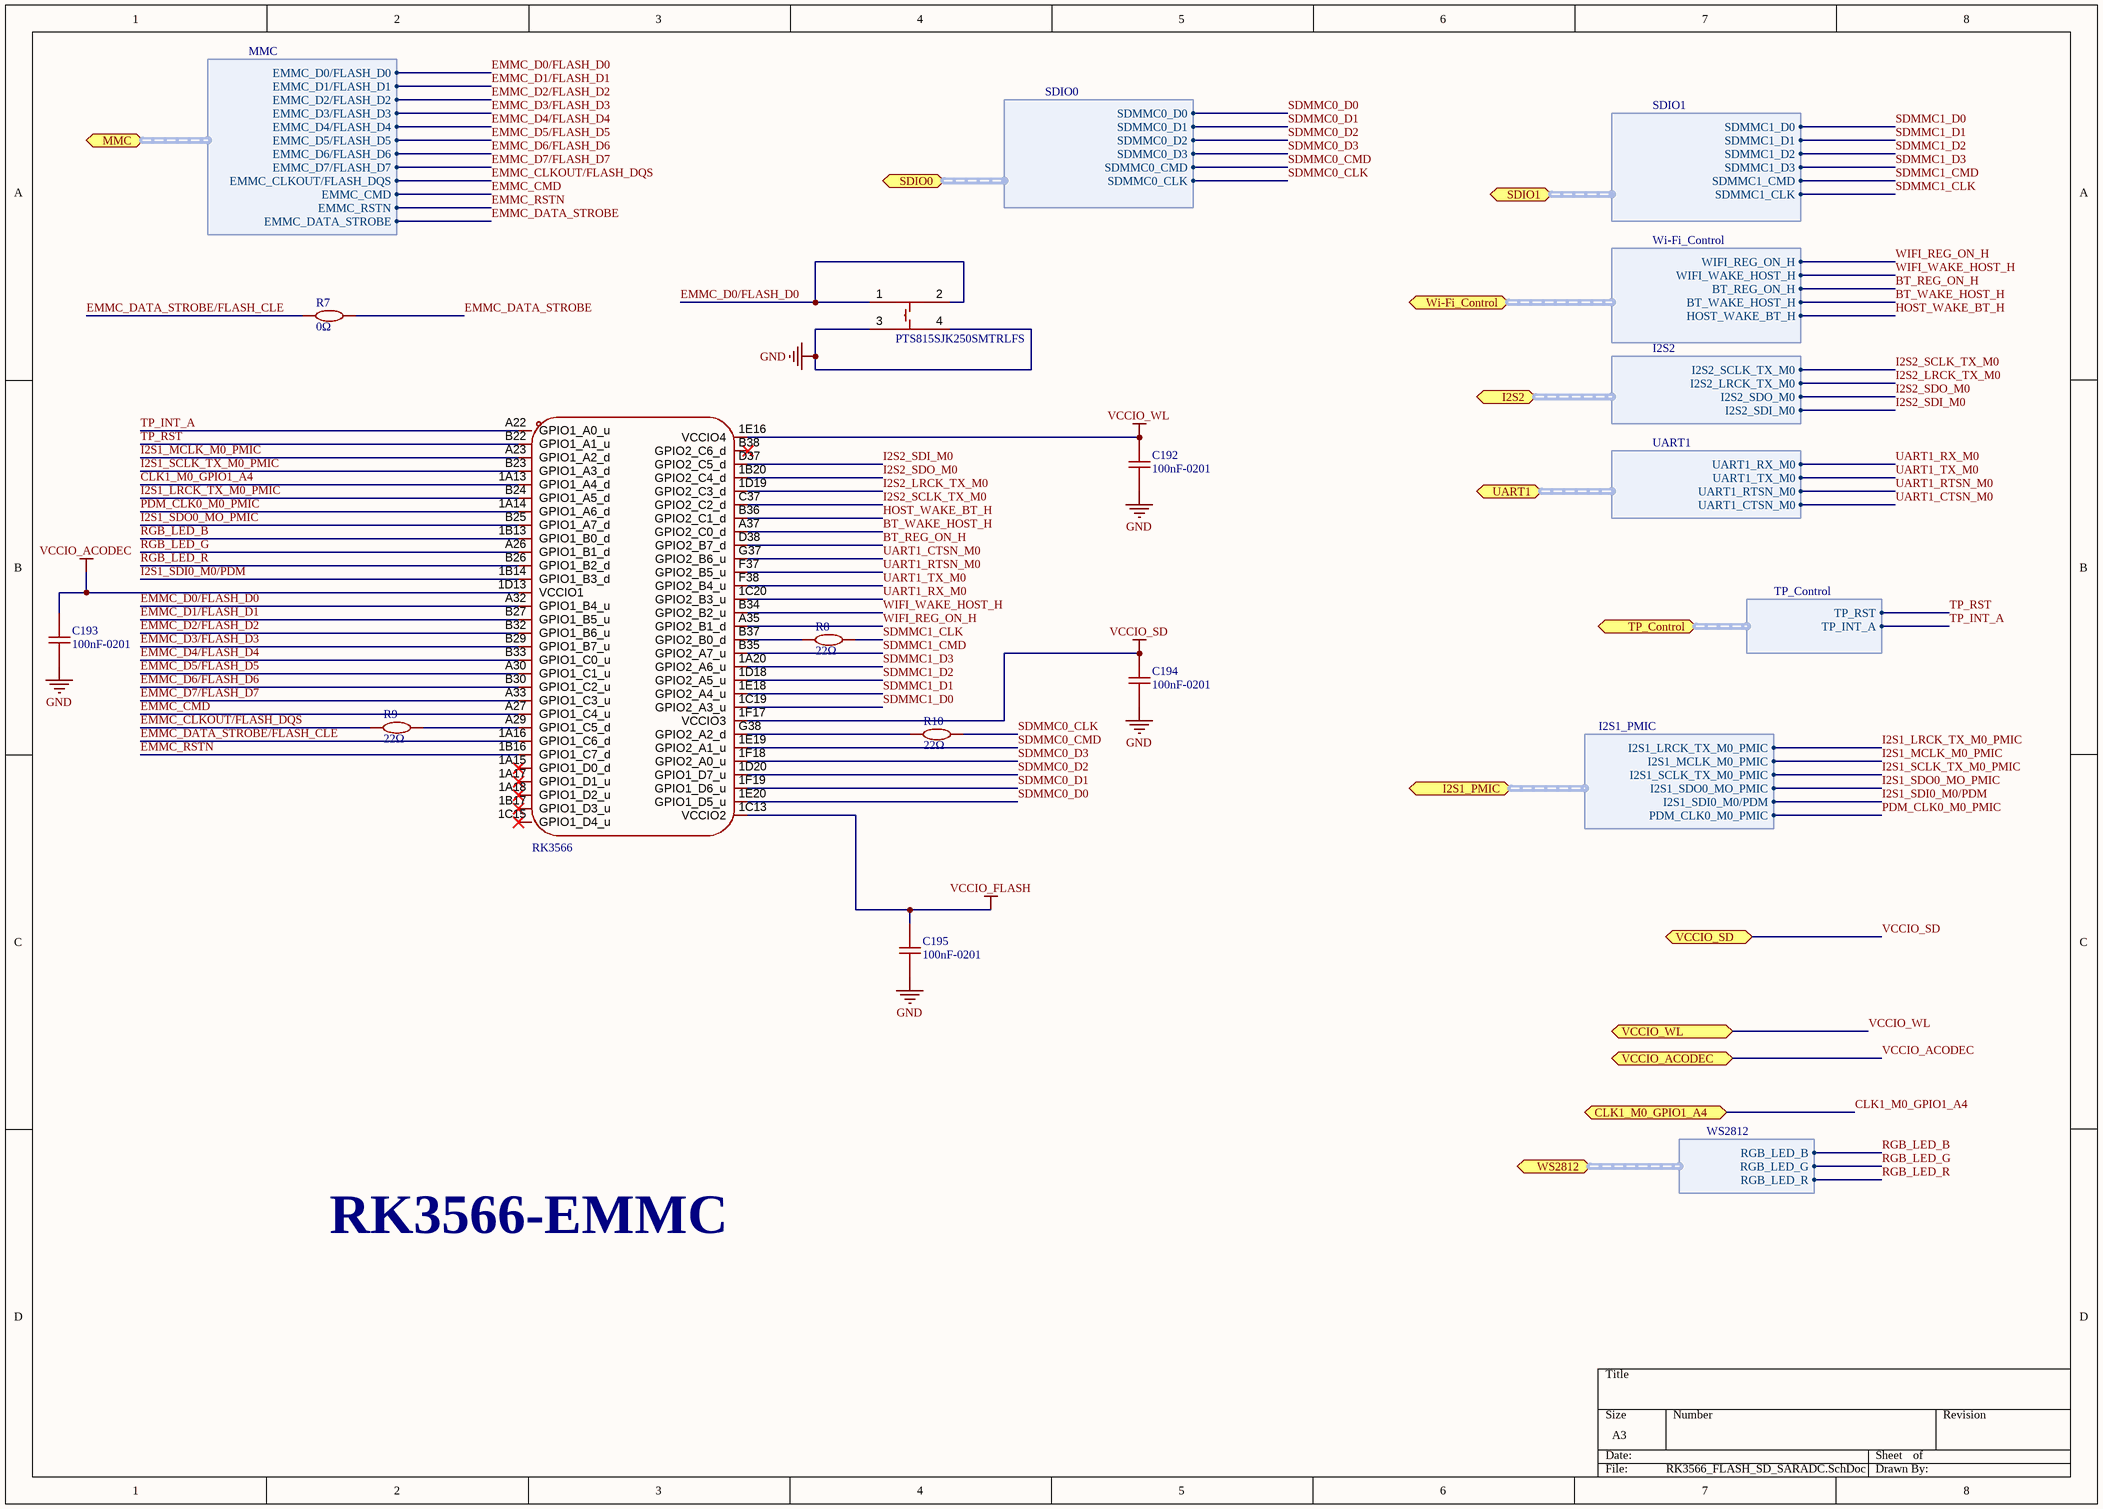
[diagram p3: RK3566_FLASH_SD_SARADC.SchDoc]

### Parts
C192  100nF-0201  [C0201]
C193  100nF-0201  [C0201]
C194  100nF-0201  [C0201]
C195  100nF-0201  [C0201]
R7  0Ω  [R0402]
R8  22Ω  [R0402]
R9  22Ω  [R0402]
R10  22Ω  [R0402]
SW4  PTS815SJK250SMTRLFS  [SW-SMD_4P-L4.2-W3.3-P2.15-LS5.1]
U2  RK3566  [BGA-565_L15.5-W14.4-P0.40_RK3566_1]  (part E of 8)

### Ports
CLK1_M0_GPIO1_A4 (bidir, see RK3566[1B], DEBUG_AND_GPIO[5A], RK3566[3B]), I2S1_PMIC (bidir, harness I2S1_PMIC, see RK3566[2B], POWER[2D], POWER_PMIC[3A], RK3566[3B]), I2S2 (bidir, harness I2S2, see RK3566[2B], RK3566[3B], Wi-Fi_BT[3B]), MMC (bidir, harness MMC, see RK3566[2B], EMMC_SD[3D], RK3566[3B]), SDIO0 (bidir, harness SDIO0, see RK3566[2B], EMMC_SD[6C], RK3566[3B]), SDIO1 (bidir, harness SDIO1, see RK3566[2B], RK3566[3B], Wi-Fi_BT[3A]), TP_Control (bidir, harness TP_Control, see RK3566[2B], MIPI_DSI_TP[2D], RK3566[3B]), UART1 (bidir, harness UARt1, see RK3566[2B], RK3566[3B], Wi-Fi_BT[6A]), VCCIO_ACODEC (bidir, see RK3566[2B], POWER[3D], POWER_PMIC[1D], RK3566[3B]), VCCIO_SD (bidir, see RK3566[2B], POWER[3D], POWER_PMIC[2D], RK3566[3B]), VCCIO_WL (bidir, see RK3566[2B], POWER[4D], POWER_EXTENSION[1A], POWER_PMIC[1D], POWER_PMIC[4A], RK3566[3B]), Wi-Fi_Control (bidir, harness Wi-Fi_Control, see RK3566[2B], RK3566[3B], Wi-Fi_BT[2A]), WS2812 (bidir, harness WS2812, see RK3566[1B], DEBUG_AND_GPIO[1C], RK3566[3B])

### Harnesses
MMC: EMMC_D0/FLASH_D0, EMMC_D1/FLASH_D1, EMMC_D2/FLASH_D2, EMMC_D3/FLASH_D3, EMMC_D4/FLASH_D4, EMMC_D5/FLASH_D5, EMMC_D6/FLASH_D6, EMMC_D7/FLASH_D7, EMMC_CLKOUT/FLASH_DQS, EMMC_CMD, EMMC_RSTN, EMMC_DATA_STROBE
SDIO0: SDMMC0_D0, SDMMC0_D1, SDMMC0_D2, SDMMC0_D3, SDMMC0_CMD, SDMMC0_CLK
SDIO1: SDMMC1_D0, SDMMC1_D1, SDMMC1_D2, SDMMC1_D3, SDMMC1_CMD, SDMMC1_CLK
Wi-Fi_Control: WIFI_REG_ON_H, WIFI_WAKE_HOST_H, BT_REG_ON_H, BT_WAKE_HOST_H, HOST_WAKE_BT_H
I2S2: I2S2_SCLK_TX_M0, I2S2_LRCK_TX_M0, I2S2_SDO_M0, I2S2_SDI_M0
UART1: UART1_RX_M0, UART1_TX_M0, UART1_RTSN_M0, UART1_CTSN_M0
TP_Control: TP_RST, TP_INT_A
I2S1_PMIC: I2S1_MCLK_M0_PMIC, I2S1_SCLK_TX_M0_PMIC, I2S1_SDO0_MO_PMIC, I2S1_SDI0_M0/PDM, I2S1_LRCK_TX_M0_PMIC, PDM_CLK0_M0_PMIC
WS2812: RGB_LED_B, RGB_LED_G, RGB_LED_R

### Nets
GND: C192.1 C193.1 C194.1 C195.1 SW4.3 SW4.4
VCCIO_ACODEC: C193.2 U2.1D13(VCCIO1) ; port VCCIO_ACODEC
VCCIO_FLASH: C195.2 U2.1C13(VCCIO2)
VCCIO_SD: C194.2 U2.1F17(VCCIO3) ; port VCCIO_SD
VCCIO_WL: C192.2 U2.1E16(VCCIO4) ; port VCCIO_WL
BT_REG_ON_H: U2.D38(GPIO2_B7_d) ; port Wi-Fi_Control.BT_REG_ON_H
BT_WAKE_HOST_H: U2.A37(GPIO2_C0_d) ; port Wi-Fi_Control.BT_WAKE_HOST_H
CLK1_M0_GPIO1_A4: U2.1A13(GPIO1_A4_d) ; port CLK1_M0_GPIO1_A4
EMMC_CLKOUT/FLASH_DQS: R9.1 ; port MMC.EMMC_CLKOUT/FLASH_DQS
EMMC_CMD: U2.A27(GPIO1_C4_u) ; port MMC.EMMC_CMD
EMMC_D0/FLASH_D0: SW4.1 SW4.2 U2.A32(GPIO1_B4_u) ; port MMC.EMMC_D0/FLASH_D0
EMMC_D1/FLASH_D1: U2.B27(GPIO1_B5_u) ; port MMC.EMMC_D1/FLASH_D1
EMMC_D2/FLASH_D2: U2.B32(GPIO1_B6_u) ; port MMC.EMMC_D2/FLASH_D2
EMMC_D3/FLASH_D3: U2.B29(GPIO1_B7_u) ; port MMC.EMMC_D3/FLASH_D3
EMMC_D4/FLASH_D4: U2.B33(GPIO1_C0_u) ; port MMC.EMMC_D4/FLASH_D4
EMMC_D5/FLASH_D5: U2.A30(GPIO1_C1_u) ; port MMC.EMMC_D5/FLASH_D5
EMMC_D6/FLASH_D6: U2.B30(GPIO1_C2_u) ; port MMC.EMMC_D6/FLASH_D6
EMMC_D7/FLASH_D7: U2.A33(GPIO1_C3_u) ; port MMC.EMMC_D7/FLASH_D7
EMMC_DATA_STROBE: R7.2 ; port MMC.EMMC_DATA_STROBE
EMMC_DATA_STROBE/FLASH_CLE: R7.1 U2.1A16(GPIO1_C6_d)
EMMC_RSTN: U2.1B16(GPIO1_C7_d) ; port MMC.EMMC_RSTN
HOST_WAKE_BT_H: U2.B36(GPIO2_C1_d) ; port Wi-Fi_Control.HOST_WAKE_BT_H
I2S1_LRCK_TX_M0_PMIC: U2.B24(GPIO1_A5_d) ; port I2S1_PMIC.I2S1_LRCK_TX_M0_PMIC
I2S1_MCLK_M0_PMIC: U2.A23(GPIO1_A2_d) ; port I2S1_PMIC.I2S1_MCLK_M0_PMIC
I2S1_SCLK_TX_M0_PMIC: U2.B23(GPIO1_A3_d) ; port I2S1_PMIC.I2S1_SCLK_TX_M0_PMIC
I2S1_SDI0_M0/PDM: U2.1B14(GPIO1_B3_d) ; port I2S1_PMIC.I2S1_SDI0_M0/PDM
I2S1_SDO0_MO_PMIC: U2.B25(GPIO1_A7_d) ; port I2S1_PMIC.I2S1_SDO0_MO_PMIC
I2S2_LRCK_TX_M0: U2.1D19(GPIO2_C3_d) ; port I2S2.I2S2_LRCK_TX_M0
I2S2_SCLK_TX_M0: U2.C37(GPIO2_C2_d) ; port I2S2.I2S2_SCLK_TX_M0
I2S2_SDI_M0: U2.D37(GPIO2_C5_d) ; port I2S2.I2S2_SDI_M0
I2S2_SDO_M0: U2.1B20(GPIO2_C4_d) ; port I2S2.I2S2_SDO_M0
PDM_CLK0_M0_PMIC: U2.1A14(GPIO1_A6_d) ; port I2S1_PMIC.PDM_CLK0_M0_PMIC
RGB_LED_B: U2.1B13(GPIO1_B0_d) ; port WS2812.RGB_LED_B
RGB_LED_G: U2.A26(GPIO1_B1_d) ; port WS2812.RGB_LED_G
RGB_LED_R: U2.B26(GPIO1_B2_d) ; port WS2812.RGB_LED_R
SDMMC0_CLK: R10.2 ; port SDIO0.SDMMC0_CLK
SDMMC0_CMD: U2.1E19(GPIO2_A1_u) ; port SDIO0.SDMMC0_CMD
SDMMC0_D0: U2.1E20(GPIO1_D5_u) ; port SDIO0.SDMMC0_D0
SDMMC0_D1: U2.1F19(GPIO1_D6_u) ; port SDIO0.SDMMC0_D1
SDMMC0_D2: U2.1D20(GPIO1_D7_u) ; port SDIO0.SDMMC0_D2
SDMMC0_D3: U2.1F18(GPIO2_A0_u) ; port SDIO0.SDMMC0_D3
SDMMC1_CLK: R8.2 ; port SDIO1.SDMMC1_CLK
SDMMC1_CMD: U2.B35(GPIO2_A7_u) ; port SDIO1.SDMMC1_CMD
SDMMC1_D0: U2.1C19(GPIO2_A3_u) ; port SDIO1.SDMMC1_D0
SDMMC1_D1: U2.1E18(GPIO2_A4_u) ; port SDIO1.SDMMC1_D1
SDMMC1_D2: U2.1D18(GPIO2_A5_u) ; port SDIO1.SDMMC1_D2
SDMMC1_D3: U2.1A20(GPIO2_A6_u) ; port SDIO1.SDMMC1_D3
TP_INT_A: U2.A22(GPIO1_A0_u) ; port TP_Control.TP_INT_A
TP_RST: U2.B22(GPIO1_A1_u) ; port TP_Control.TP_RST
UART1_CTSN_M0: U2.G37(GPIO2_B6_u) ; port UART1.UART1_CTSN_M0
UART1_RTSN_M0: U2.F37(GPIO2_B5_u) ; port UART1.UART1_RTSN_M0
UART1_RX_M0: U2.1C20(GPIO2_B3_u) ; port UART1.UART1_RX_M0
UART1_TX_M0: U2.F38(GPIO2_B4_u) ; port UART1.UART1_TX_M0
WIFI_REG_ON_H: U2.A35(GPIO2_B1_d) ; port Wi-Fi_Control.WIFI_REG_ON_H
WIFI_WAKE_HOST_H: U2.B34(GPIO2_B2_u) ; port Wi-Fi_Control.WIFI_WAKE_HOST_H
NetR8_1: R8.1 U2.B37(GPIO2_B0_d)
NetR9_2: R9.2 U2.A29(GPIO1_C5_d)
NetR10_1: R10.1 U2.G38(GPIO2_A2_d)

Not connected (* = marked no-connect by the designer): U2 1A15(GPIO1_D0_d)* 1A17(GPIO1_D1_u)* 1A18(GPIO1_D2_u)* 1B17(GPIO1_D3_u)* 1C15(GPIO1_D4_u)* B38(GPIO2_C6_d)*

### Notes on the sheet
- RK3566-EMMC

### Library data of the parts
C192-C195 = 100nF-0201: CL03A104KO3NNNC
R7 = 0Ω: 0Ω 62.5mW 50V Thick Film Resistor ±1% 0402 Chip Resistor - Surface Mount ROHS
R8-R10 = 22Ω: 62.5mW 33Ω 50V ±100ppm/℃ Thick Film Resistor ±1% 0402 Chip Resistor - Surface Mount ROHS
SW4 = PTS815SJK250SMTRLFS: 4pin 轻触开关 SMD​; Symbol: PTS815SJK250SMTRLFS
U2 = RK3566: BGA-565(15.5x14.4); Symbol: RK3566

## Sheet RK3566_USB_GPIO.SchDoc
size A3; SheetNumber: 18; SheetTotal: 20
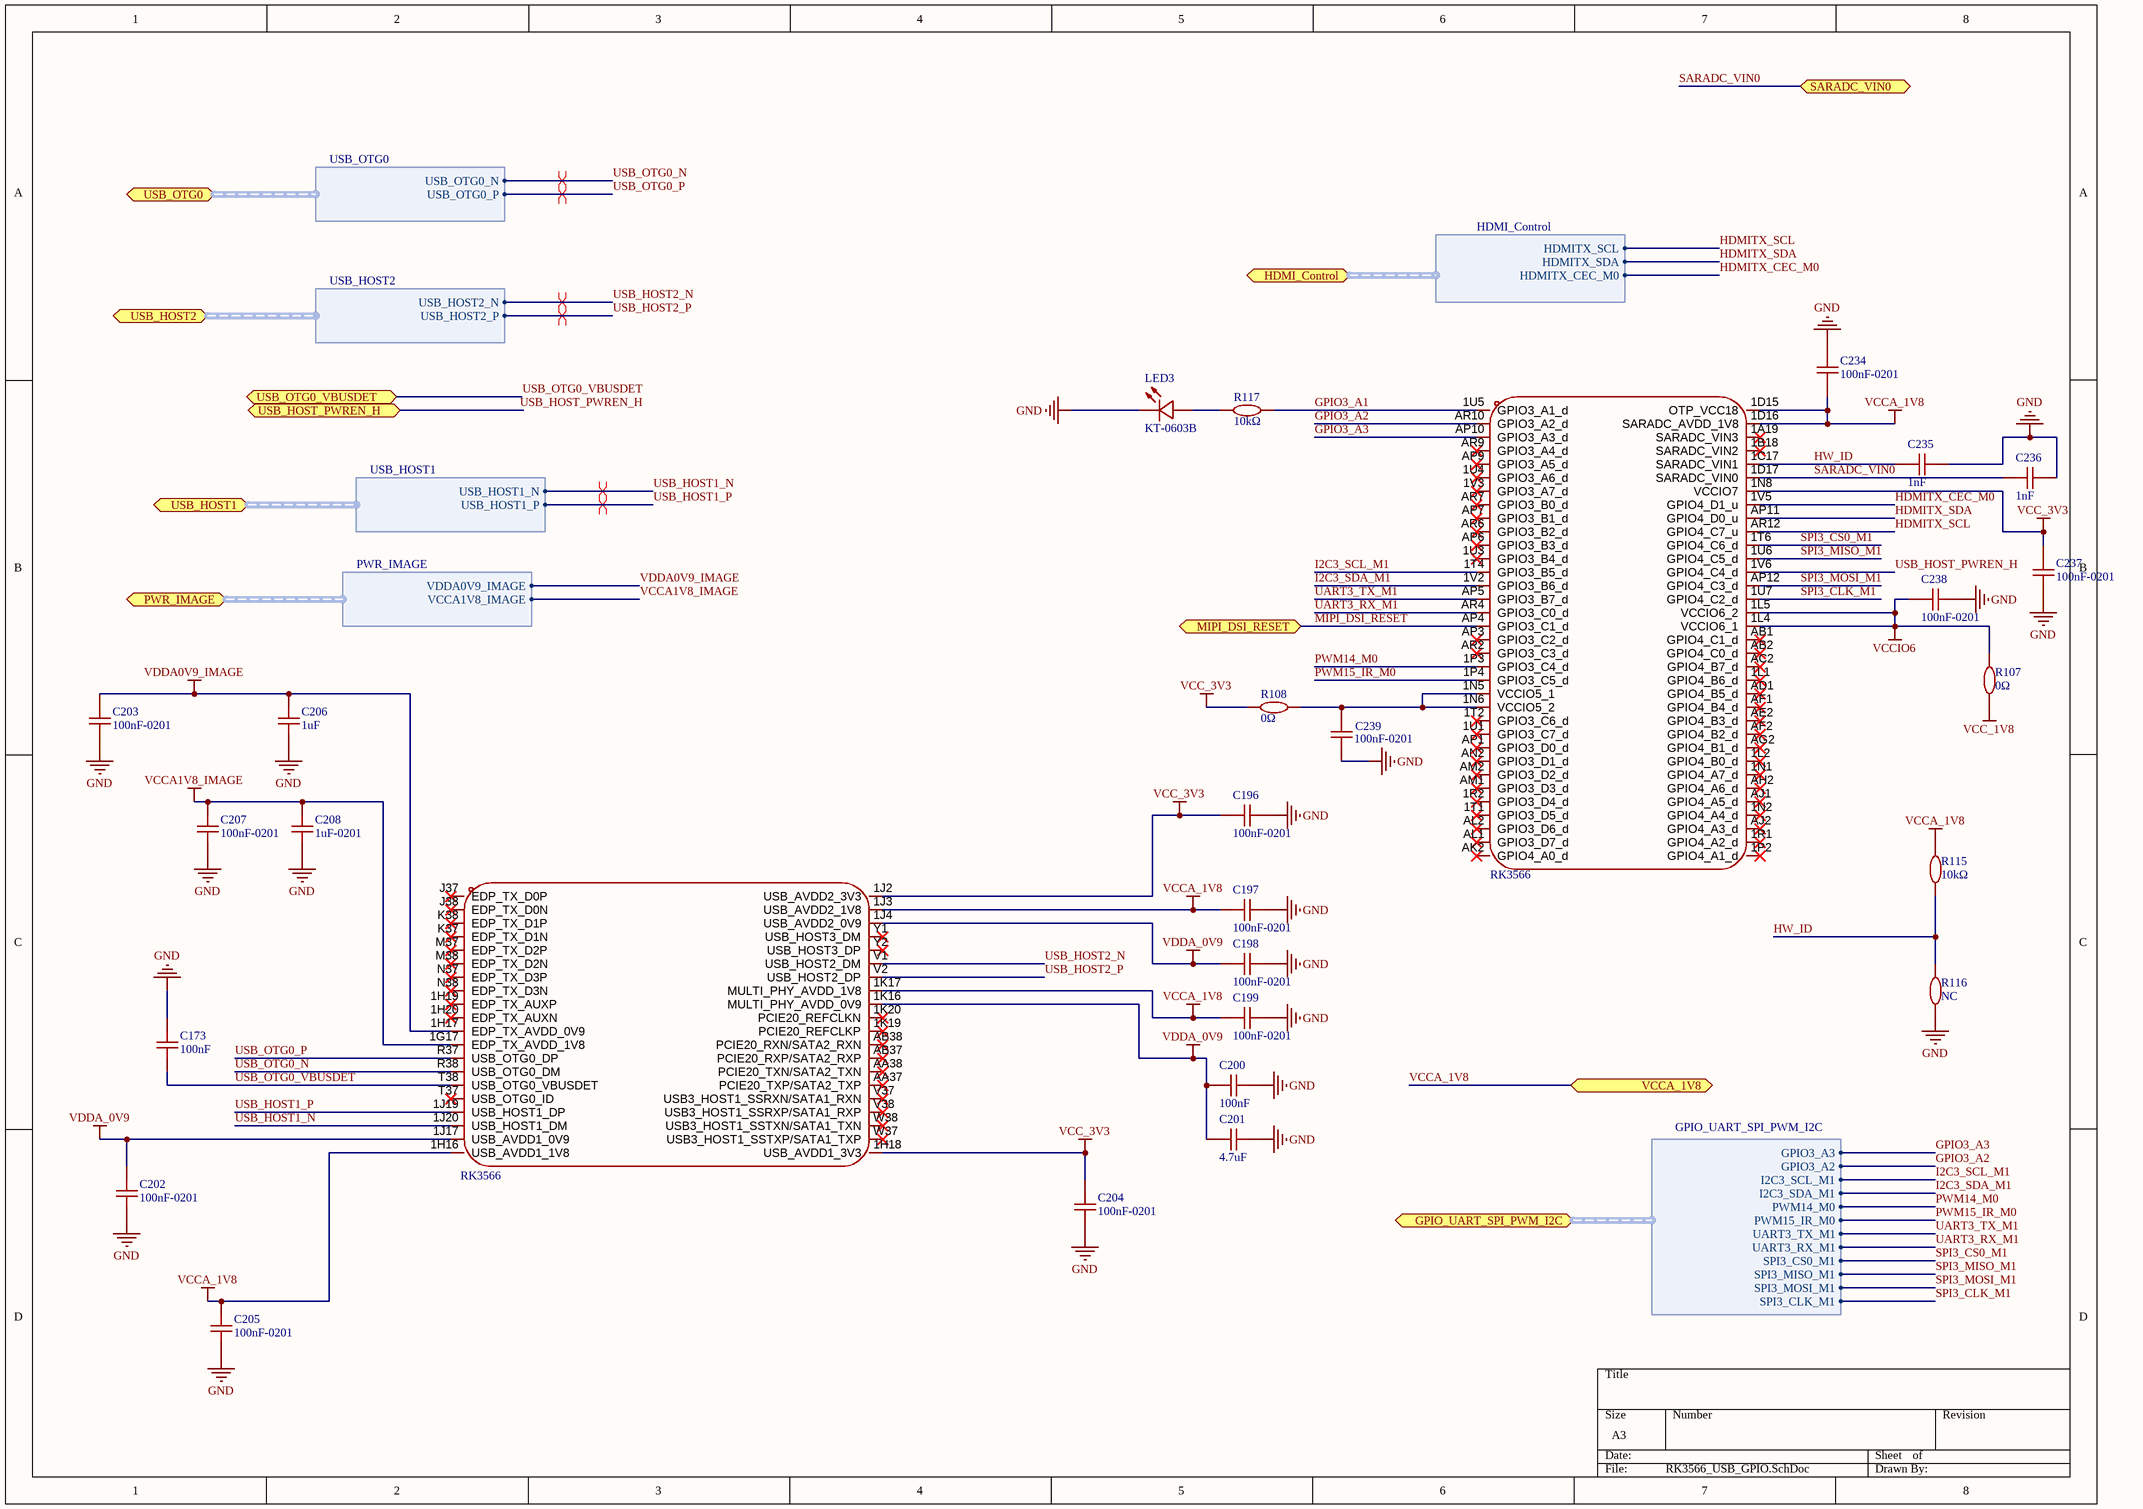
[diagram p4: RK3566_USB_GPIO.SchDoc]

### Parts
C173  100nF  [C0402]
C196  100nF-0201  [C0201]
C197  100nF-0201  [C0201]
C198  100nF-0201  [C0201]
C199  100nF-0201  [C0201]
C200  100nF  [C0402]
C201  4.7uF  [C0402]
C202  100nF-0201  [C0201]
C203  100nF-0201  [C0201]
C204  100nF-0201  [C0201]
C205  100nF-0201  [C0201]
C206  1uF  [C0402]
C207  100nF-0201  [C0201]
C208  1uF-0201  [C0201]
C234  100nF-0201  [C0201]
C235  1nF  [C0402]
C236  1nF  [C0402]
C237  100nF-0201  [C0201]
C238  100nF-0201  [C0201]
C239  100nF-0201  [C0201]
LED3  KT-0603B  [LED0603-BL]
R107  0Ω  [R0402]
R108  0Ω  [R0402]
R115  10kΩ  [R0402]
R116  NC  [R0402]
R117  10kΩ  [R0402]
U2  RK3566  [BGA-565_L15.5-W14.4-P0.40_RK3566_1]  (parts F,H of 8)

### Ports
GPIO_UART_SPI_PWM_I2C (bidir, harness GPIO_UART_SPI_PWM_I2C, see RK3566[1C], DEBUG_AND_GPIO[6A], RK3566[3C]), HDMI_Control (bidir, harness HDMI_Control, see RK3566[2C], HDMI[2D], RK3566[3C]), MIPI_DSI_RESET (bidir, see RK3566[2C], MIPI_DSI_TP[5C], RK3566[3C]), PWR_IMAGE (bidir, harness PWR_IMAGE, see RK3566[2C], POWER[1C], POWER_PMIC[3B], RK3566[3C], RK3566_MIPI_HDMI[5D]), SARADC_VIN0 (bidir, see RK3566[2C], DEBUG_AND_GPIO[6C], RK3566[3C]), USB_HOST1 (bidir, harness USB_HOST1, see RK3566[2C], RK3566[3C], USB_OTG_AND_HOST[6A]), USB_HOST2 (bidir, harness USB_HOST2, see RK3566[2C], RK3566[3C], USB_OTG_AND_HOST[6@]), USB_HOST_PWREN_H (bidir, see RK3566[2C], RK3566[3C], USB_OTG_AND_HOST[7@]), USB_OTG0 (bidir, harness USB_OTG0, see RK3566[2C], RK3566[3C], USB_OTG_AND_HOST[6@]), USB_OTG0_VBUSDET (bidir, see RK3566[2C], RK3566[3C], USB_OTG_AND_HOST[7@]), VCCA_1V8 (bidir, see RK3566[1C], DEBUG_AND_GPIO[6C], POWER[1C], POWER_PMIC[7A], RK3566[3C])

### Harnesses
HDMI_Control: HDMITX_SCL, HDMITX_SDA, HDMITX_CEC_M0
USB_OTG0: USB_OTG0_N, USB_OTG0_P
USB_HOST2: USB_HOST2_N, USB_HOST2_P
USB_HOST1: USB_HOST1_N, USB_HOST1_P
PWR_IMAGE: VDDA0V9_IMAGE, VCCA1V8_IMAGE
GPIO_UART_SPI_PWM_I2C: I2C3_SDA_M1, PWM14_M0, PWM15_IR_M0, I2C3_SCL_M1, GPIO3_A2, UART3_TX_M1, SPI3_CS0_M1, UART3_RX_M1, SPI3_MISO_M1, SPI3_MOSI_M1, SPI3_CLK_M1, GPIO3_A3

### Nets
GND: C173.2 C196.2 C197.2 C198.2 C199.2 C200.2 C201.2 C202.1 C203.1 C204.1 C205.1 C206.1 C207.1 C208.1 C234.1 C235.2 C236.2 C237.2 C238.2 C239.1 LED3.1(K) R116.1
VCC_1V8: R107.1
VCC_3V3: C196.1 C204.2 C237.1 R108.1 U2.1H18(USB_AVDD1_3V3) U2.1J2(USB_AVDD2_3V3) U2.1N8(VCCIO7)
VCCA1V8_IMAGE: C207.2 C208.2 U2.1G17(EDP_TX_AVDD_1V8) ; port PWR_IMAGE.VCCA1V8_IMAGE
VCCA_1V8: C197.1 C199.1 C205.2 C234.2 R115.2 U2.1D15(OTP_VCC18) U2.1D16(SARADC_AVDD_1V8) U2.1H16(USB_AVDD1_1V8) U2.1J3(USB_AVDD2_1V8) U2.1K17(MULTI_PHY_AVDD_1V8) ; port VCCA_1V8
VCCIO6: C238.1 R107.2 U2.1L4(VCCIO6_1) U2.1L5(VCCIO6_2)
VDDA0V9_IMAGE: C203.2 C206.2 U2.1H17(EDP_TX_AVDD_0V9) ; port PWR_IMAGE.VDDA0V9_IMAGE
VDDA_0V9: C198.1 C200.1 C201.1 C202.2 U2.1J4(USB_AVDD2_0V9) U2.1J17(USB_AVDD1_0V9) U2.1K16(MULTI_PHY_AVDD_0V9)
GPIO3_A1: R117.1 U2.1U5(GPIO3_A1_d)
GPIO3_A2: U2.AR10(GPIO3_A2_d) ; port GPIO_UART_SPI_PWM_I2C.GPIO3_A2
GPIO3_A3: U2.AP10(GPIO3_A3_d) ; port GPIO_UART_SPI_PWM_I2C.GPIO3_A3
HDMITX_CEC_M0: U2.1V5(GPIO4_D1_u) ; port HDMI_Control.HDMITX_CEC_M0
HDMITX_SCL: U2.AR12(GPIO4_C7_u) ; port HDMI_Control.HDMITX_SCL
HDMITX_SDA: U2.AP11(GPIO4_D0_u) ; port HDMI_Control.HDMITX_SDA
HW_ID: C235.1 R115.1 R116.2 U2.1C17(SARADC_VIN1)
I2C3_SCL_M1: U2.1T4(GPIO3_B5_d) ; port GPIO_UART_SPI_PWM_I2C.I2C3_SCL_M1
I2C3_SDA_M1: U2.1V2(GPIO3_B6_d) ; port GPIO_UART_SPI_PWM_I2C.I2C3_SDA_M1
MIPI_DSI_RESET: U2.AP4(GPIO3_C1_d) ; port MIPI_DSI_RESET
PWM14_M0: U2.1P3(GPIO3_C4_d) ; port GPIO_UART_SPI_PWM_I2C.PWM14_M0
PWM15_IR_M0: U2.1P4(GPIO3_C5_d) ; port GPIO_UART_SPI_PWM_I2C.PWM15_IR_M0
SARADC_VIN0: C236.1 U2.1D17(SARADC_VIN0) ; port SARADC_VIN0
SPI3_CLK_M1: U2.1U7(GPIO4_C2_d) ; port GPIO_UART_SPI_PWM_I2C.SPI3_CLK_M1
SPI3_CS0_M1: U2.1T6(GPIO4_C6_d) ; port GPIO_UART_SPI_PWM_I2C.SPI3_CS0_M1
SPI3_MISO_M1: U2.1U6(GPIO4_C5_d) ; port GPIO_UART_SPI_PWM_I2C.SPI3_MISO_M1
SPI3_MOSI_M1: U2.AP12(GPIO4_C3_d) ; port GPIO_UART_SPI_PWM_I2C.SPI3_MOSI_M1
UART3_RX_M1: U2.AR4(GPIO3_C0_d) ; port GPIO_UART_SPI_PWM_I2C.UART3_RX_M1
UART3_TX_M1: U2.AP5(GPIO3_B7_d) ; port GPIO_UART_SPI_PWM_I2C.UART3_TX_M1
USB_HOST1_N: U2.1J20(USB_HOST1_DM) ; port USB_HOST1.USB_HOST1_N
USB_HOST1_P: U2.1J19(USB_HOST1_DP) ; port USB_HOST1.USB_HOST1_P
USB_HOST2_N: U2.V1(USB_HOST2_DM) ; port USB_HOST2.USB_HOST2_N
USB_HOST2_P: U2.V2(USB_HOST2_DP) ; port USB_HOST2.USB_HOST2_P
USB_HOST_PWREN_H: U2.1V6(GPIO4_C4_d) ; port USB_HOST_PWREN_H
USB_OTG0_N: U2.R38(USB_OTG0_DM) ; port USB_OTG0.USB_OTG0_N
USB_OTG0_P: U2.R37(USB_OTG0_DP) ; port USB_OTG0.USB_OTG0_P
USB_OTG0_VBUSDET: C173.1 U2.T38(USB_OTG0_VBUSDET) ; port USB_OTG0_VBUSDET
NetC239_2: C239.2 R108.2 U2.1N5(VCCIO5_1) U2.1N6(VCCIO5_2)
NetLED3_2: LED3.2(A) R117.2

Not connected (* = marked no-connect by the designer): U2 1A19(SARADC_VIN3)* 1B18(SARADC_VIN2)* 1H19(EDP_TX_AUXP)* 1H20(EDP_TX_AUXN)* 1K19(PCIE20_REFCLKP)* 1K20(PCIE20_REFCLKN)* 1L1(GPIO4_B6_d)* 1L2(GPIO4_B0_d)* 1N1(GPIO4_A7_d)* 1N2(GPIO4_A4_d)* 1P2(GPIO4_A1_d)* 1R1(GPIO4_A2_d)* 1R2(GPIO3_D4_d)* 1T1(GPIO3_D5_d)* 1T2(GPIO3_C6_d)* 1U1(GPIO3_C7_d)* 1U3(GPIO3_B4_d)* 1U4(GPIO3_A6_d)* 1V3(GPIO3_A7_d)* AA37(PCIE20_TXP/SATA2_TXP)* AA38(PCIE20_TXN/SATA2_TXN)* AB1(GPIO4_C1_d)* AB2(GPIO4_C0_d)* AB37(PCIE20_RXP/SATA2_RXP)* AB38(PCIE20_RXN/SATA2_RXN)* AC2(GPIO4_B7_d)* AD1(GPIO4_B5_d)* AE2(GPIO4_B3_d)* AF1(GPIO4_B4_d)* AF2(GPIO4_B2_d)* AG2(GPIO4_B1_d)* AH2(GPIO4_A6_d)* AJ1(GPIO4_A5_d)* AJ2(GPIO4_A3_d)* AK2(GPIO4_A0_d)* AL1(GPIO3_D7_d)* AL2(GPIO3_D6_d)* AM1(GPIO3_D3_d)* AM2(GPIO3_D2_d)* AN2(GPIO3_D1_d)* AP1(GPIO3_D0_d)* AP3(GPIO3_C2_d)* AP6(GPIO3_B3_d)* AP7(GPIO3_B1_d)* AP9(GPIO3_A5_d)* AR2(GPIO3_C3_d)* AR6(GPIO3_B2_d)* AR7(GPIO3_B0_d)* AR9(GPIO3_A4_d)* J37(EDP_TX_D0P)* J38(EDP_TX_D0N)* K37(EDP_TX_D1N)* K38(EDP_TX_D1P)* M37(EDP_TX_D2P)* M38(EDP_TX_D2N)* N37(EDP_TX_D3P)* N38(EDP_TX_D3N)* T37(USB_OTG0_ID)* V37(USB3_HOST1_SSRXN/SATA1_RXN)* V38(USB3_HOST1_SSRXP/SATA1_RXP)* W37(USB3_HOST1_SSTXP/SATA1_TXP)* W38(USB3_HOST1_SSTXN/SATA1_TXN)* Y1(USB_HOST3_DM)* Y2(USB_HOST3_DP)*

### Layout directives
differential pair: USB_HOST1_N, USB_HOST1_P, USB_HOST2_N, USB_HOST2_P, USB_OTG0_N, USB_OTG0_P

### Library data of the parts
C173 C200 = 100nF: 50V 100nF X7R ±10% 0402 Ceramic Capacitors ROHS
C196-C199 C202-C205 C207 C234 C237-C239 = 100nF-0201: CL03A104KO3NNNC
C201 = 4.7uF: as C183 on sheet RK3566_DDR_PHY
C206 = 1uF: 50V 1uF X5R ±10% 0402 Ceramic Capacitors ROHS
C208 = 1uF-0201: CL03A104KO3NNNC
C235 C236 = 1nF: 50V 1nF X7R ±10% 0402 Ceramic Capacitors ROHS
LED3 = KT-0603B: 30mA 2.6V~3.2V Blue 0603 LED Indication - Discrete ROHS
R107 R108 = 0Ω: as R7 on sheet RK3566_FLASH_SD_SARADC
R115-R117 = 10kΩ: 62.5mW 10kΩ 50V ±100ppm/℃ Thick Film Resistor ±1% 0402 Chip Resistor - Surface Mount ROHS
U2 = RK3566: BGA-565(15.5x14.4); Symbol: RK3566

## Sheet RK3566_MIPI_HDMI.SchDoc
size A3; SheetNumber: 19; SheetTotal: 20
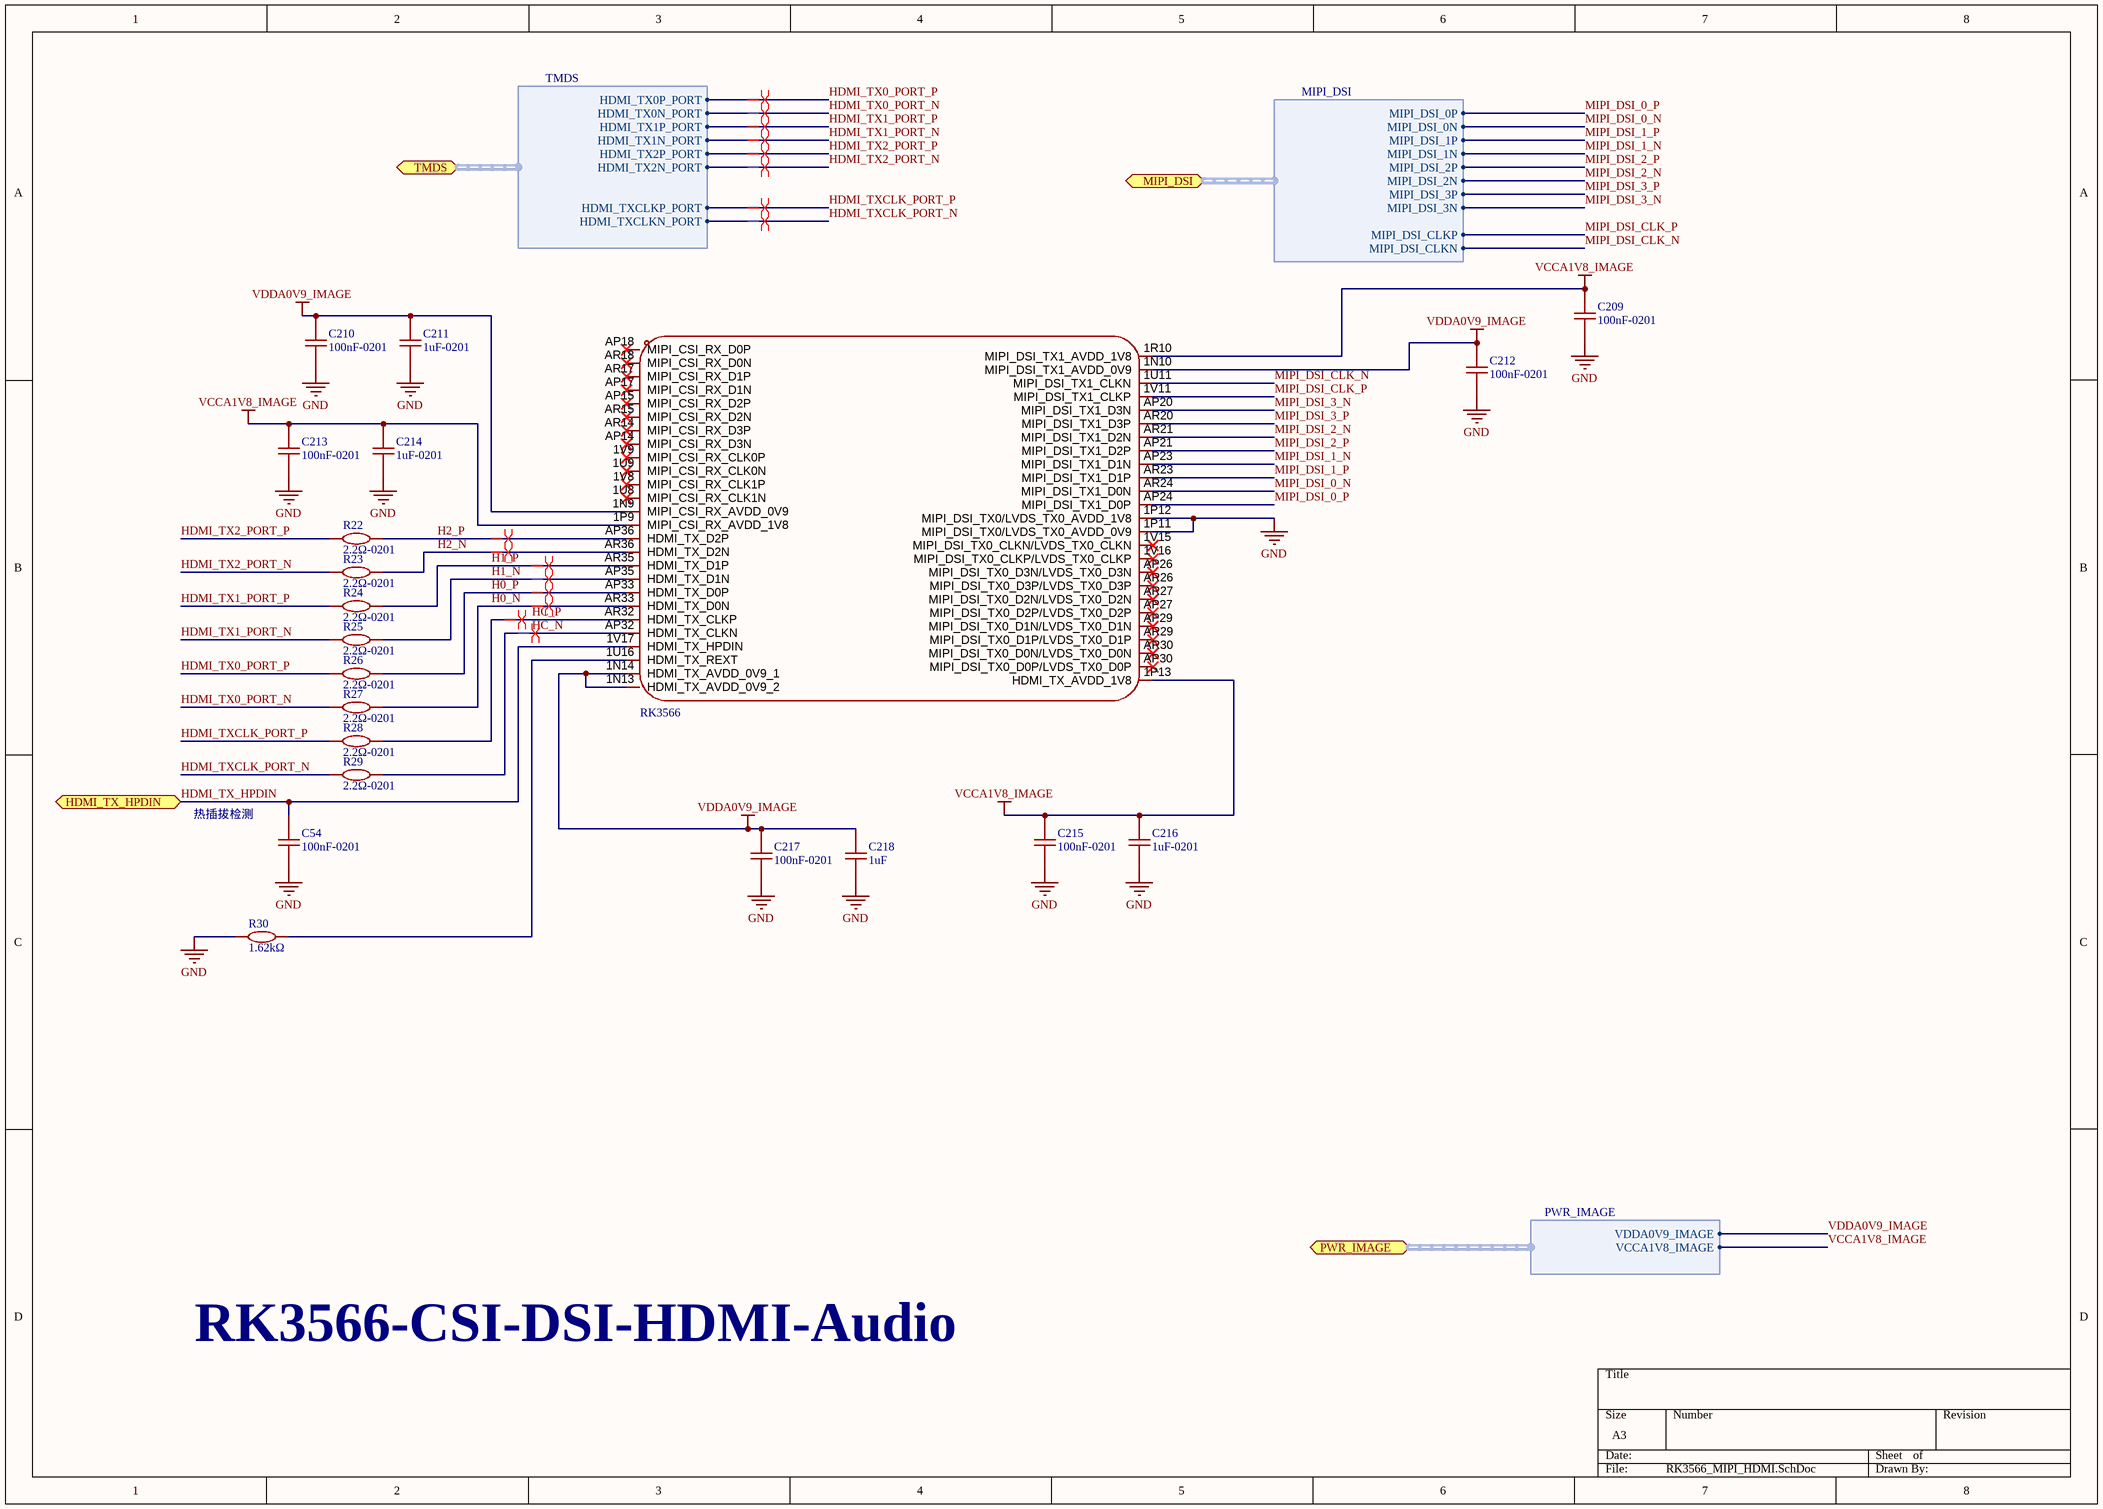
[diagram p5: RK3566_MIPI_HDMI.SchDoc]

### Parts
C54  100nF-0201  [C0201]
C209  100nF-0201  [C0201]
C210  100nF-0201  [C0201]
C211  1uF-0201  [C0201]
C212  100nF-0201  [C0201]
C213  100nF-0201  [C0201]
C214  1uF-0201  [C0201]
C215  100nF-0201  [C0201]
C216  1uF-0201  [C0201]
C217  100nF-0201  [C0201]
C218  1uF  [C0402]
R22  2.2Ω-0201  [R0201]
R23  2.2Ω-0201  [R0201]
R24  2.2Ω-0201  [R0201]
R25  2.2Ω-0201  [R0201]
R26  2.2Ω-0201  [R0201]
R27  2.2Ω-0201  [R0201]
R28  2.2Ω-0201  [R0201]
R29  2.2Ω-0201  [R0201]
R30  1.62kΩ  [R0402]
U2  RK3566  [BGA-565_L15.5-W14.4-P0.40_RK3566_1]  (part G of 8)

### Ports
HDMI_TX_HPDIN (bidir, see RK3566[2A], HDMI[8A], RK3566[3A]), MIPI_DSI (bidir, harness MIPI_DSI, see RK3566[2B], MIPI_DSI_TP[6A], RK3566[3B]), PWR_IMAGE (bidir, harness PWR_IMAGE, see RK3566[2B], POWER[1C], POWER_PMIC[3B], RK3566[3C], RK3566_USB_GPIO[1B]), TMDS (bidir, harness TMDS, see RK3566[2A], HDMI[2D], RK3566[3A])

### Harnesses
MIPI_DSI: MIPI_DSI_0P, MIPI_DSI_0N, MIPI_DSI_1P, MIPI_DSI_1N, MIPI_DSI_2P, MIPI_DSI_2N, MIPI_DSI_CLKP, MIPI_DSI_3P, MIPI_DSI_3N, MIPI_DSI_CLKN
PWR_IMAGE: VDDA0V9_IMAGE, VCCA1V8_IMAGE
TMDS: HDMI_TX0P_PORT, HDMI_TX0N_PORT, HDMI_TX1P_PORT, HDMI_TX1N_PORT, HDMI_TX2P_PORT, HDMI_TX2N_PORT, HDMI_TXCLKP_PORT, HDMI_TXCLKN_PORT

### Nets
GND: C54.1 C209.1 C210.1 C211.1 C212.1 C213.1 C214.1 C215.1 C216.1 C217.1 C218.1 R30.1 U2.1P11(MIPI_DSI_TX0/LVDS_TX0_AVDD_0V9) U2.1P12(MIPI_DSI_TX0/LVDS_TX0_AVDD_1V8)
VCCA1V8_IMAGE: C209.2 C213.2 C214.2 C215.2 C216.2 U2.1P9(MIPI_CSI_RX_AVDD_1V8) U2.1P13(HDMI_TX_AVDD_1V8) U2.1R10(MIPI_DSI_TX1_AVDD_1V8) ; port PWR_IMAGE.VCCA1V8_IMAGE
VDDA0V9_IMAGE: C210.2 C211.2 C212.2 C217.2 C218.2 U2.1N9(MIPI_CSI_RX_AVDD_0V9) U2.1N10(MIPI_DSI_TX1_AVDD_0V9) U2.1N13(HDMI_TX_AVDD_0V9_2) U2.1N14(HDMI_TX_AVDD_0V9_1) ; port PWR_IMAGE.VDDA0V9_IMAGE
H0_N: R27.2 U2.AR33(HDMI_TX_D0N)
H0_P: R26.2 U2.AP33(HDMI_TX_D0P)
H1_N: R25.2 U2.AP35(HDMI_TX_D1N)
H1_P: R24.2 U2.AR35(HDMI_TX_D1P)
H2_N: R23.2 U2.AR36(HDMI_TX_D2N)
H2_P: R22.2 U2.AP36(HDMI_TX_D2P)
HC_N: R29.2 U2.AP32(HDMI_TX_CLKN)
HC_P: R28.2 U2.AR32(HDMI_TX_CLKP)
HDMI_TX0_PORT_N: R27.1 ; port TMDS.HDMI_TX0N_PORT  [project net HDMI_TX0_N]
HDMI_TX0_PORT_P: R26.1 ; port TMDS.HDMI_TX0P_PORT  [project net HDMI_TX0_P]
HDMI_TX1_PORT_N: R25.1 ; port TMDS.HDMI_TX1N_PORT  [project net HDMI_TX1_N]
HDMI_TX1_PORT_P: R24.1 ; port TMDS.HDMI_TX1P_PORT  [project net HDMI_TX1_P]
HDMI_TX2_PORT_N: R23.1 ; port TMDS.HDMI_TX2N_PORT  [project net HDMI_TX2_N]
HDMI_TX2_PORT_P: R22.1 ; port TMDS.HDMI_TX2P_PORT  [project net HDMI_TX2_P]
HDMI_TX_HPDIN: C54.2 U2.1V17(HDMI_TX_HPDIN) ; port HDMI_TX_HPDIN
HDMI_TXCLK_PORT_N: R29.1 ; port TMDS.HDMI_TXCLKN_PORT  [project net HDMI_TXC_N]
HDMI_TXCLK_PORT_P: R28.1 ; port TMDS.HDMI_TXCLKP_PORT  [project net HDMI_TXC_P]
MIPI_DSI_0_N: U2.AR24(MIPI_DSI_TX1_D0N) ; port MIPI_DSI.MIPI_DSI_0N
MIPI_DSI_0_P: U2.AP24(MIPI_DSI_TX1_D0P) ; port MIPI_DSI.MIPI_DSI_0P
MIPI_DSI_1_N: U2.AP23(MIPI_DSI_TX1_D1N) ; port MIPI_DSI.MIPI_DSI_1N
MIPI_DSI_1_P: U2.AR23(MIPI_DSI_TX1_D1P) ; port MIPI_DSI.MIPI_DSI_1P
MIPI_DSI_2_N: U2.AR21(MIPI_DSI_TX1_D2N) ; port MIPI_DSI.MIPI_DSI_2N
MIPI_DSI_2_P: U2.AP21(MIPI_DSI_TX1_D2P) ; port MIPI_DSI.MIPI_DSI_2P
MIPI_DSI_3_N: U2.AP20(MIPI_DSI_TX1_D3N) ; port MIPI_DSI.MIPI_DSI_3N
MIPI_DSI_3_P: U2.AR20(MIPI_DSI_TX1_D3P) ; port MIPI_DSI.MIPI_DSI_3P
MIPI_DSI_CLK_N: U2.1U11(MIPI_DSI_TX1_CLKN) ; port MIPI_DSI.MIPI_DSI_CLKN
MIPI_DSI_CLK_P: U2.1V11(MIPI_DSI_TX1_CLKP) ; port MIPI_DSI.MIPI_DSI_CLKP
NetR30_2: R30.2 U2.1U16(HDMI_TX_REXT)

Not connected (* = marked no-connect by the designer): U2 1U8(MIPI_CSI_RX_CLK1N)* 1U9(MIPI_CSI_RX_CLK0N)* 1V8(MIPI_CSI_RX_CLK1P)* 1V9(MIPI_CSI_RX_CLK0P)* 1V15(MIPI_DSI_TX0_CLKN/LVDS_TX0_CLKN)* 1V16(MIPI_DSI_TX0_CLKP/LVDS_TX0_CLKP)* AP14(MIPI_CSI_RX_D3N)* AP15(MIPI_CSI_RX_D2P)* AP17(MIPI_CSI_RX_D1N)* AP18(MIPI_CSI_RX_D0P)* AP26(MIPI_DSI_TX0_D3N/LVDS_TX0_D3N)* AP27(MIPI_DSI_TX0_D2P/LVDS_TX0_D2P)* AP29(MIPI_DSI_TX0_D1N/LVDS_TX0_D1N)* AP30(MIPI_DSI_TX0_D0P/LVDS_TX0_D0P)* AR14(MIPI_CSI_RX_D3P)* AR15(MIPI_CSI_RX_D2N)* AR17(MIPI_CSI_RX_D1P)* AR18(MIPI_CSI_RX_D0N)* AR26(MIPI_DSI_TX0_D3P/LVDS_TX0_D3P)* AR27(MIPI_DSI_TX0_D2N/LVDS_TX0_D2N)* AR29(MIPI_DSI_TX0_D1P/LVDS_TX0_D1P)* AR30(MIPI_DSI_TX0_D0N/LVDS_TX0_D0N)*

### Layout directives
differential pair: H0_N, H0_P, H1_N, H1_P, H2_N, H2_P, HC_N, HC_P, HDMI_TX0_N, HDMI_TX0_P, HDMI_TX1_N, HDMI_TX1_P, HDMI_TX2_N, HDMI_TX2_P, HDMI_TXC_N, HDMI_TXC_P

### Notes on the sheet
- 热插拔检测
- RK3566-CSI-DSI-HDMI-Audio

### Library data of the parts
C54 C209 C210 C212 C213 C215 C217 = 100nF-0201: CL03A104KO3NNNC
C211 C214 C216 = 1uF-0201: CL03A104KO3NNNC
C218 = 1uF: as C206 on sheet RK3566_USB_GPIO
R22-R29 = 2.2Ω-0201: 小尺寸、重量轻。降低组装成本,与贴片机匹配。适用于波峰焊和回流焊
R30 = 1.62kΩ: 特性：无卤环氧树脂。符合RoHS标准。无铅端接产品符合RoHS要求。RoHS豁免电极、电阻元件和玻璃中含有的铅玻璃。减少对环境有害的废物。高组件和设备可靠性。应用：所有通用应用
U2 = RK3566: BGA-565(15.5x14.4); Symbol: RK3566

## Sheet RK3566_OSC_PLL_PMUO1_2.SchDoc
size A3; SheetNumber: 20; SheetTotal: 20
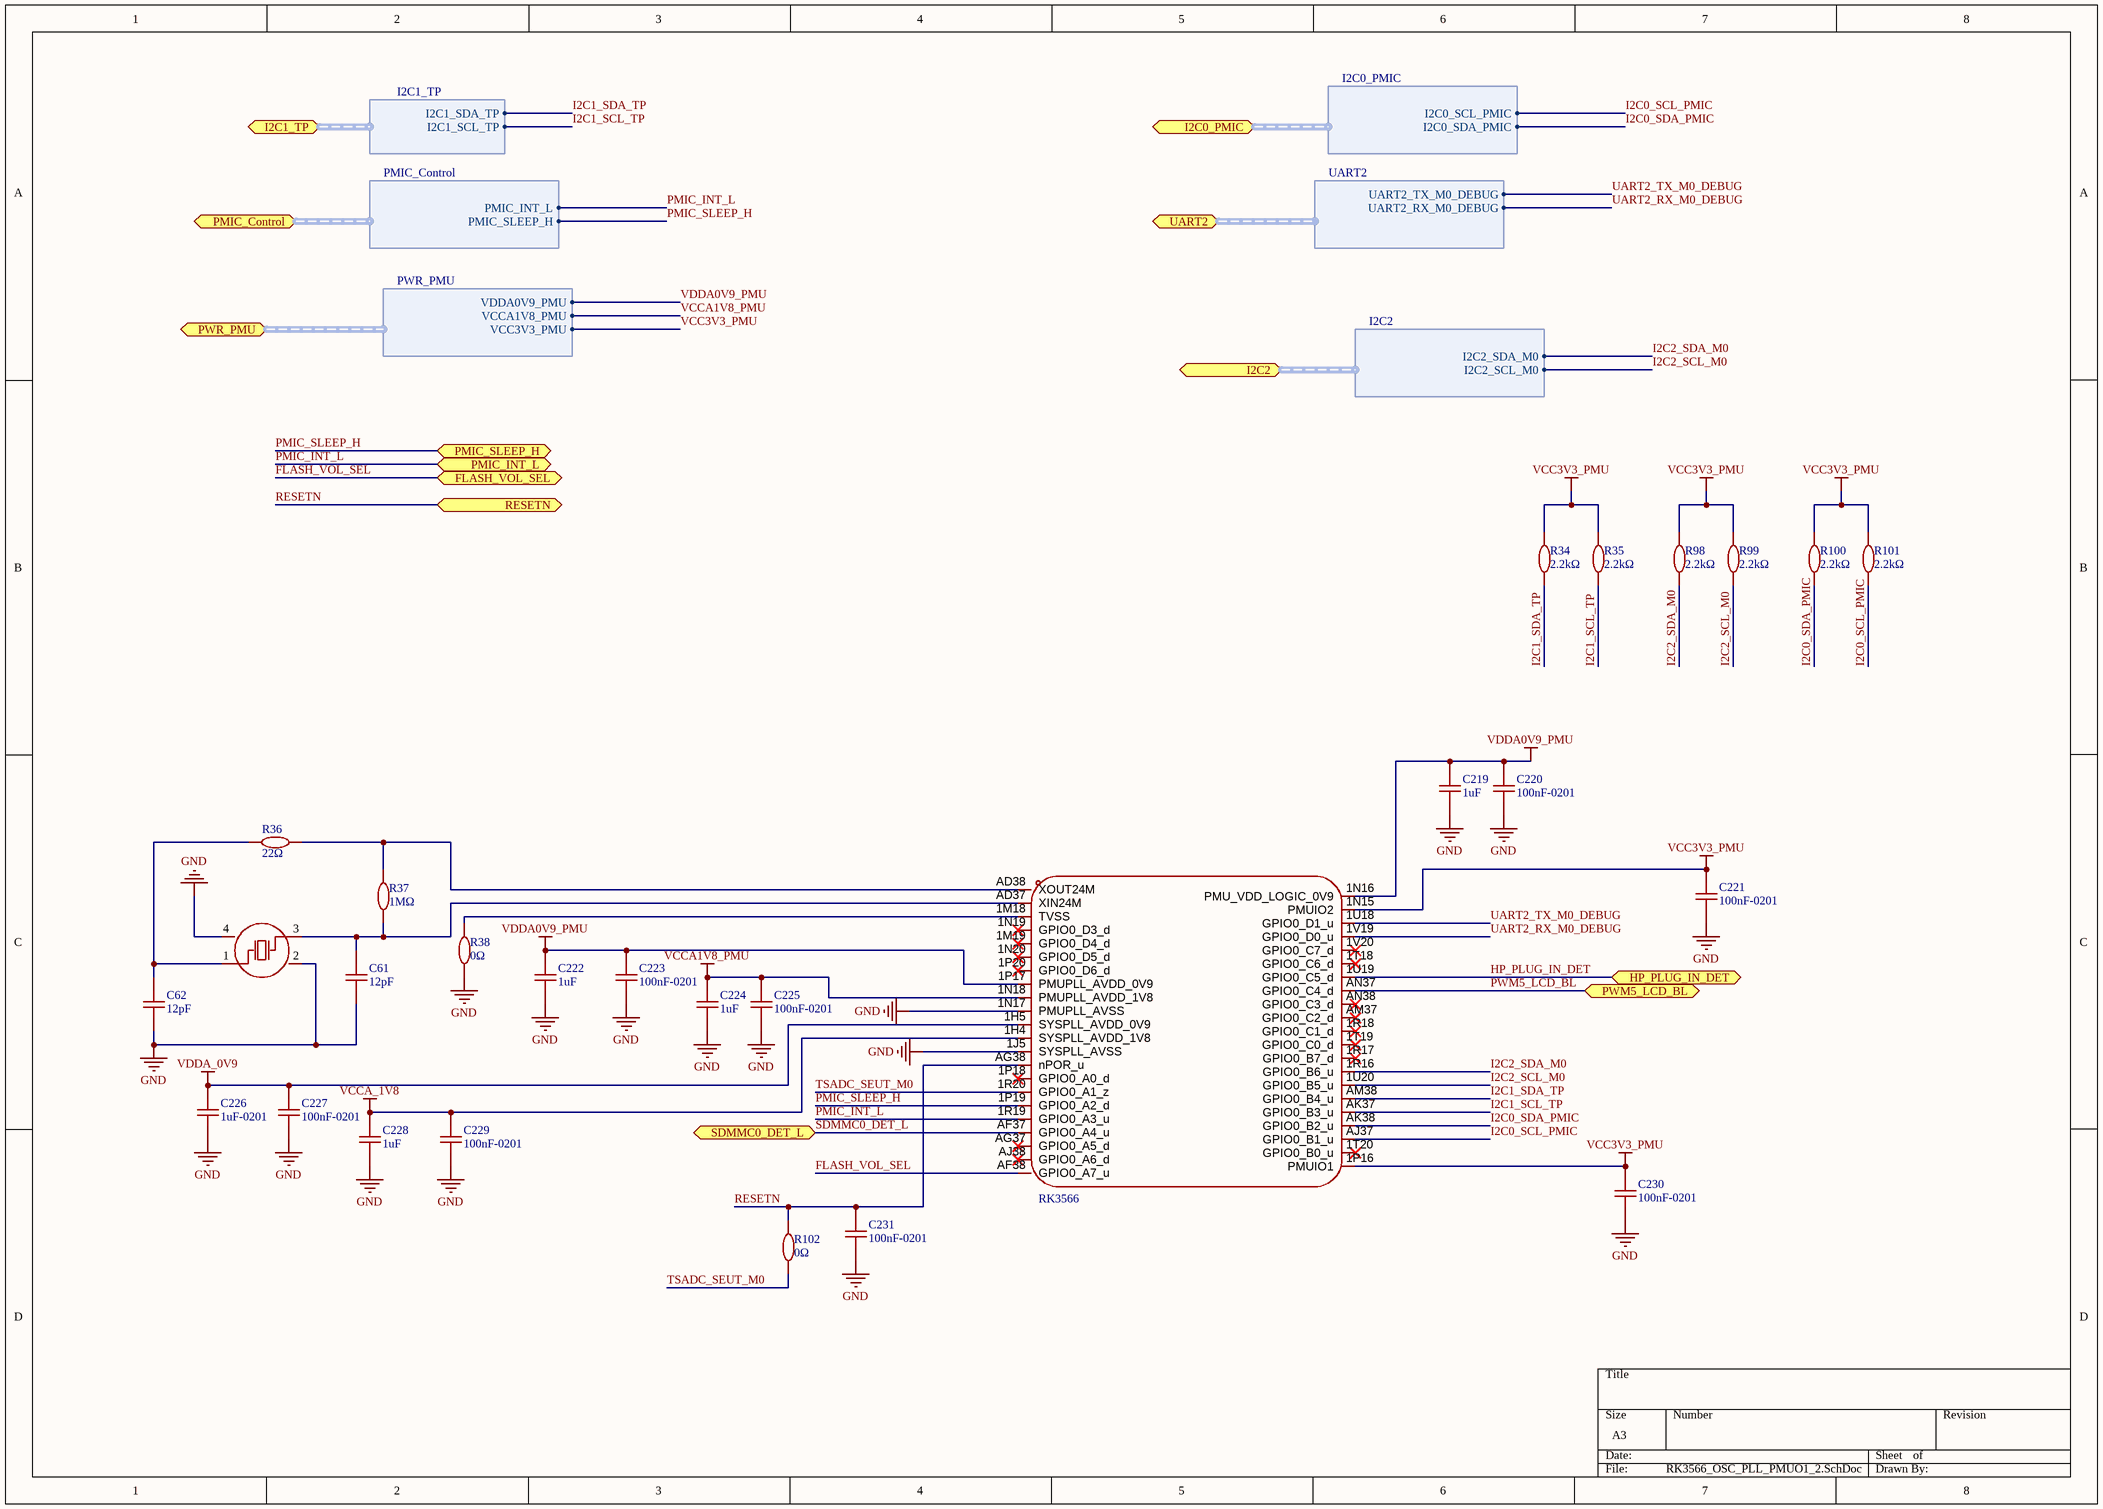
[diagram p6: RK3566_OSC_PLL_PMUO1_2.SchDoc]

### Parts
C61  12pF  [C0402]
C62  12pF  [C0402]
C219  1uF  [C0402]
C220  100nF-0201  [C0201]
C221  100nF-0201  [C0201]
C222  1uF  [C0402]
C223  100nF-0201  [C0201]
C224  1uF  [C0402]
C225  100nF-0201  [C0201]
C226  1uF-0201  [C0201]
C227  100nF-0201  [C0201]
C228  1uF  [C0402]
C229  100nF-0201  [C0201]
C230  100nF-0201  [C0201]
C231  100nF-0201  [C0201]
R34  2.2kΩ  [R0402]
R35  2.2kΩ  [R0402]
R36  22Ω  [R0402]
R37  1MΩ  [R0402]
R38  0Ω  [R0402]
R98  2.2kΩ  [R0402]
R99  2.2kΩ  [R0402]
R100  2.2kΩ  [R0402]
R101  2.2kΩ  [R0402]
R102  0Ω  [R0402]
U2  RK3566  [BGA-565_L15.5-W14.4-P0.40_RK3566_1]  (part D of 8)
X2  24MHz  [CRYSTAL-SMD_4P-L3.2-W2.5-BL]  (value not drawn)

### Ports
FLASH_VOL_SEL (bidir, see RK3566[1D], POWER[6D], POWER_FLASH_POWER_MANAGE[3A], RK3566[3D]), HP_PLUG_IN_DET (bidir, see RK3566[2C], Audio_AND_HPJ[4C], RK3566[3C]), I2C0_PMIC (bidir, harness I2C0_PMIC, see RK3566[2D], POWER[4D], POWER_EXTENSION[4A], POWER_PMIC[1A], RK3566[3D]), I2C1_TP (bidir, harness I2C1_TP, see RK3566[2C], MIPI_DSI_TP[3D], RK3566[3C]), I2C2 (bidir, harness I2C2, see RK3566[2C], DEBUG_AND_GPIO[6B], RK3566[3C]), PMIC_Control (bidir, harness PMIC_Control, see RK3566[2D], POWER[3D], POWER_PMIC[4A], RK3566[3D]), PMIC_INT_L (bidir, see RK3566[1D], POWER[3D], POWER_PMIC[7A], RK3566[3D]), PMIC_SLEEP_H (bidir, see RK3566[1D], POWER[4D], POWER_EXTENSION[1A], POWER_PMIC[7A], RK3566[3D]), PWM5_LCD_BL (bidir, see RK3566[2D], MIPI_DSI_TP[1B], RK3566[3D]), PWR_PMU (bidir, harness PWR_PMU, see RK3566[2C], LPDDR4[4C], POWER[2D], POWER_PMIC[4D], RK3566[3C]), RESETN (bidir, see RK3566[2C], DEBUG_AND_GPIO[8D], POWER[1C], POWER_PMIC[7A], RK3566[3C]), SDMMC0_DET_L (bidir, see RK3566[2C], EMMC_SD[8C], RK3566[3C]), UART2 (bidir, harness UART2, see RK3566[2D], DEBUG_AND_GPIO[1B], RK3566[3D])

### Harnesses
I2C1_TP: I2C1_SDA_TP, I2C1_SCL_TP
PMIC_Control: PMIC_INT_L, PMIC_SLEEP_H
I2C0_PMIC: I2C0_SCL_PMIC, I2C0_SDA_PMIC
UART2: UART2_RX_M0_DEBUG, UART2_TX_M0_DEBUG
PWR_PMU: VCCA1V8_PMU, VDDA0V9_PMU, VCC3V3_PMU
I2C2: I2C2_SDA_M0, I2C2_SCL_M0

### Nets
GND: C61.1 C62.1 C219.1 C220.1 C221.1 C222.1 C223.1 C224.1 C225.1 C226.1 C227.1 C228.1 C229.1 C230.1 C231.1 R38.1 U2.1J5(SYSPLL_AVSS) U2.1N17(PMUPLL_AVSS) X2.2(GND) X2.4(GND)
VCC3V3_PMU: C221.2 C230.2 R34.2 R35.2 R98.2 R99.2 R100.2 R101.2 U2.1N15(PMUIO2) U2.1P16(PMUIO1) ; port PWR_PMU.VCC3V3_PMU
VCCA1V8_PMU: C224.2 C225.2 U2.1N18(PMUPLL_AVDD_1V8) ; port PWR_PMU.VCCA1V8_PMU
VCCA_1V8: C228.2 C229.2 U2.1H4(SYSPLL_AVDD_1V8)
VDDA0V9_PMU: C219.2 C220.2 C222.2 C223.2 U2.1N16(PMU_VDD_LOGIC_0V9) U2.1P17(PMUPLL_AVDD_0V9) ; port PWR_PMU.VDDA0V9_PMU
VDDA_0V9: C226.2 C227.2 U2.1H5(SYSPLL_AVDD_0V9)
FLASH_VOL_SEL: U2.AF38(GPIO0_A7_u) ; port FLASH_VOL_SEL
HP_PLUG_IN_DET: U2.1U19(GPIO0_C5_d) ; port HP_PLUG_IN_DET
I2C0_SCL_PMIC: R101.1 U2.AJ37(GPIO0_B1_u) ; port I2C0_PMIC.I2C0_SCL_PMIC
I2C0_SDA_PMIC: R100.1 U2.AK38(GPIO0_B2_u) ; port I2C0_PMIC.I2C0_SDA_PMIC
I2C1_SCL_TP: R35.1 U2.AK37(GPIO0_B3_u) ; port I2C1_TP.I2C1_SCL_TP
I2C1_SDA_TP: R34.1 U2.AM38(GPIO0_B4_u) ; port I2C1_TP.I2C1_SDA_TP
I2C2_SCL_M0: R99.1 U2.1U20(GPIO0_B5_u) ; port I2C2.I2C2_SCL_M0
I2C2_SDA_M0: R98.1 U2.1R16(GPIO0_B6_u) ; port I2C2.I2C2_SDA_M0
PMIC_INT_L: U2.1R19(GPIO0_A3_u) ; port PMIC_INT_L, port PMIC_Control.PMIC_INT_L
PMIC_SLEEP_H: U2.1P19(GPIO0_A2_d) ; port PMIC_SLEEP_H, port PMIC_Control.PMIC_SLEEP_H
PWM5_LCD_BL: U2.AN37(GPIO0_C4_d) ; port PWM5_LCD_BL
RESETN: C231.2 R102.2 U2.AG38(nPOR_u) ; port RESETN
SDMMC0_DET_L: U2.AF37(GPIO0_A4_u) ; port SDMMC0_DET_L
TSADC_SEUT_M0: R102.1 U2.1R20(GPIO0_A1_z)
UART2_RX_M0_DEBUG: U2.1V19(GPIO0_D0_u) ; port UART2.UART2_RX_M0_DEBUG
UART2_TX_M0_DEBUG: U2.1U18(GPIO0_D1_u) ; port UART2.UART2_TX_M0_DEBUG
NetC61_2: C61.2 R37.1 U2.AD37(XIN24M) X2.3(OSC2)
NetC62_2: C62.2 R36.1 X2.1(OSC1)
NetR36_2: R36.2 R37.2 U2.AD38(XOUT24M)
NetR38_2: R38.2 U2.1M18(TVSS)

Not connected (* = marked no-connect by the designer): U2 1M19(GPIO0_D4_d)* 1N19(GPIO0_D3_d)* 1N20(GPIO0_D5_d)* 1P18(GPIO0_A0_d)* 1P20(GPIO0_D6_d)* 1R17(GPIO0_B7_d)* 1R18(GPIO0_C1_d)* 1T18(GPIO0_C6_d)* 1T19(GPIO0_C0_d)* 1T20(GPIO0_B0_u)* 1V20(GPIO0_C7_d)* AG37(GPIO0_A5_d)* AJ38(GPIO0_A6_d)* AM37(GPIO0_C2_d)* AN38(GPIO0_C3_d)*

### Library data of the parts
C61 C62 = 12pF: 50V 12pF C0G ±5% 0402 Ceramic Capacitors ROHS
C219 C222 C224 C228 = 1uF: as C206 on sheet RK3566_USB_GPIO
C220 C221 C223 C225 C227 C229-C231 = 100nF-0201: CL03A104KO3NNNC
C226 = 1uF-0201: CL03A104KO3NNNC
R34 R35 R98-R101 = 2.2kΩ: 2.2kΩ ±1% 62.5mW 厚膜电阻
R36 = 22Ω: 小尺寸、重量轻。降低组装成本,与贴片机匹配。适用于波峰焊和回流焊
R37 = 1MΩ: 62.5mW 1MΩ 50V ±100ppm/℃ Thick Film Resistor ±1% 0402 Chip Resistor - Surface Mount ROHS
R38 = 0Ω-0201: 小尺寸、重量轻。降低组装成本,与贴片机匹配。适用于波峰焊和回流焊
R102 = 0Ω: as R7 on sheet RK3566_FLASH_SD_SARADC
U2 = RK3566: BGA-565(15.5x14.4); Symbol: RK3566
X2 = X322524MOB4SI: Crystal Oscillator 12pF SMD3225-4P Crystals ROHS; Manufacturer: YXC(扬兴晶振); Add into BOM: yes; Normal temperature Frequency Tolerance: ±10ppm; Frequency Stability: ±20ppm; Symbol: X322524MOB4SI; Device: X322524MOB4SI; LCSC Part Name: YSX321SL 24MHZ 4P 3225 12PF ±10PPM -40~85℃ (±20PPM); Supplier Part: C70590; Manufacturer Part: X322524MOB4SI; Supplier Footprint: SMD3225-4P; JLCPCB Part Class: Extended Part; Datasheet: https://item.szlcsc.com/datasheet/X322524MOB4SI/71688.html; Supplier: LCSC; Convert to PCB: yes; Type: Surface Mount Crystal; Value: 24MHz; Load Capacitance: 12pF; Operating Temperature: -40℃~+85℃